# Altium project Dashcam.PrjPcb (part 1 of 8)
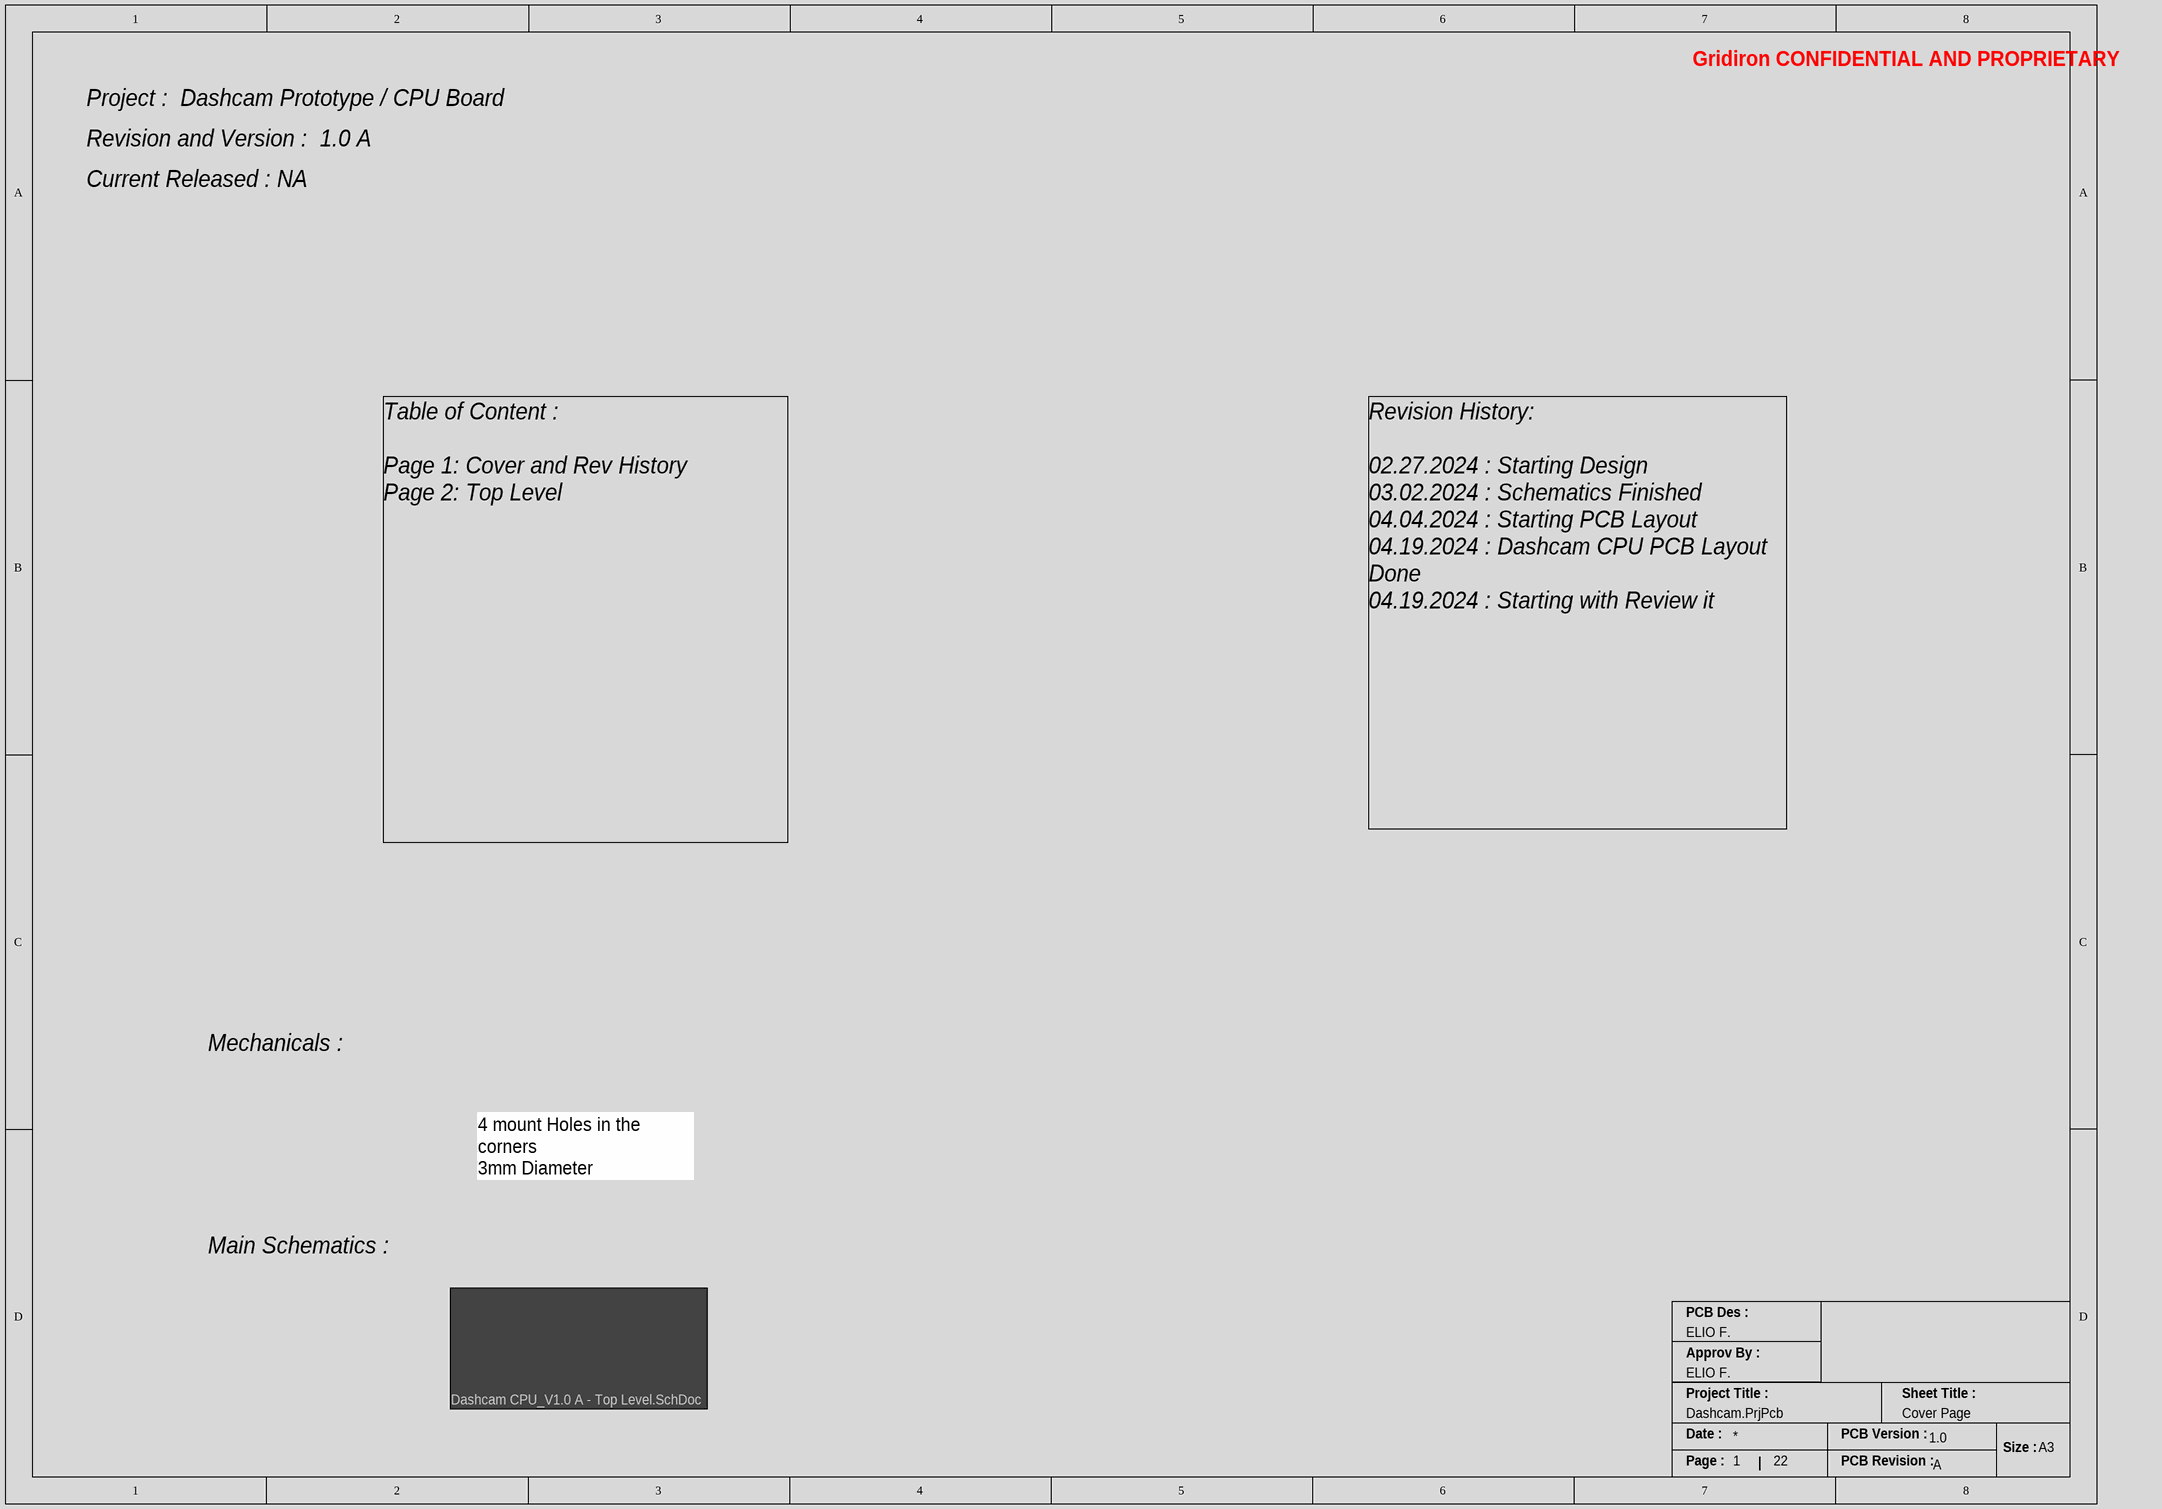
[diagram p0: Dashcam - Cover and Revision.SchDoc]
Letter: A; ProjectTitle: Dashcam CPU_V1.0 A; Version: 1.0
18 sheets, 369 parts. Net scope: hierarchical (ports join the sheet entries above them; power ports are global).
Board file: Dashcam.PcbDoc
Sheets:
  Dashcam - Cover and Revision.SchDoc
  Dashcam - Top Level.SchDoc
    A = iMX 8M PLUS.SchDoc
      H = CPU IO.SchDoc
      K = CPU PHY.SchDoc
      J = CPU MISC.SchDoc
      L = CPU Power.SchDoc
    B = Connector A.SchDoc
    C = Connector B.SchDoc
    Q = PMIC.SchDoc
      P = Converter.SchDoc
    T = DBG.SchDoc
    S = GNSS_GPS.SchDoc
    S = IMU.SchDoc
    S = MAIN_POWER.SchDoc
    S = CAMERA.SchDoc
    S = WIFI_BLE.SchDoc
    S = MICROSD.SchDoc

## Sheet Dashcam - Cover and Revision.SchDoc
size A3; Email: eliofagundez07@gmail.com; DrawnBy: ELIO F.; Engineer: ELIO F.; Revision: A; SheetNumber: 1; SheetTotal: 22; Sheet Title: Cover Page

### Sub-sheets
Z = Dashcam CPU_V1.0 A - Top Level.SchDoc (file not in this document): no entries

### Notes on the sheet
- Project :  Dashcam Prototype / CPU Board
- Gridiron CONFIDENTIAL AND PROPRIETARY
- Revision and Version :  1.0 A
- Current Released : NA
- Table of Content :
  Page 1: Cover and Rev History
  Page 2: Top Level
- Revision History:
  02.27.2024 : Starting Design
  03.02.2024 : Schematics Finished
  04.04.2024 : Starting PCB Layout
  04.19.2024 : Dashcam CPU PCB Layout Done
  04.19.2024 : Starting with Review it
- Mechanicals :
- 4 mount Holes in the corners
  3mm Diameter
- Main Schematics :
- PCB Des :
- Approv By :
- Project Title :
- Sheet Title :
- Date :
- PCB Version :
- Size :
- A3
- Page :
- PCB Revision :

## Sheet Dashcam - Top Level.SchDoc: Top Level
size A2; DrawnBy: ELIO F.; Engineer: ELIO F.; Revision: A; SheetNumber: 2; SheetTotal: 22; Sheet Title: Top Level; Version: 1.0
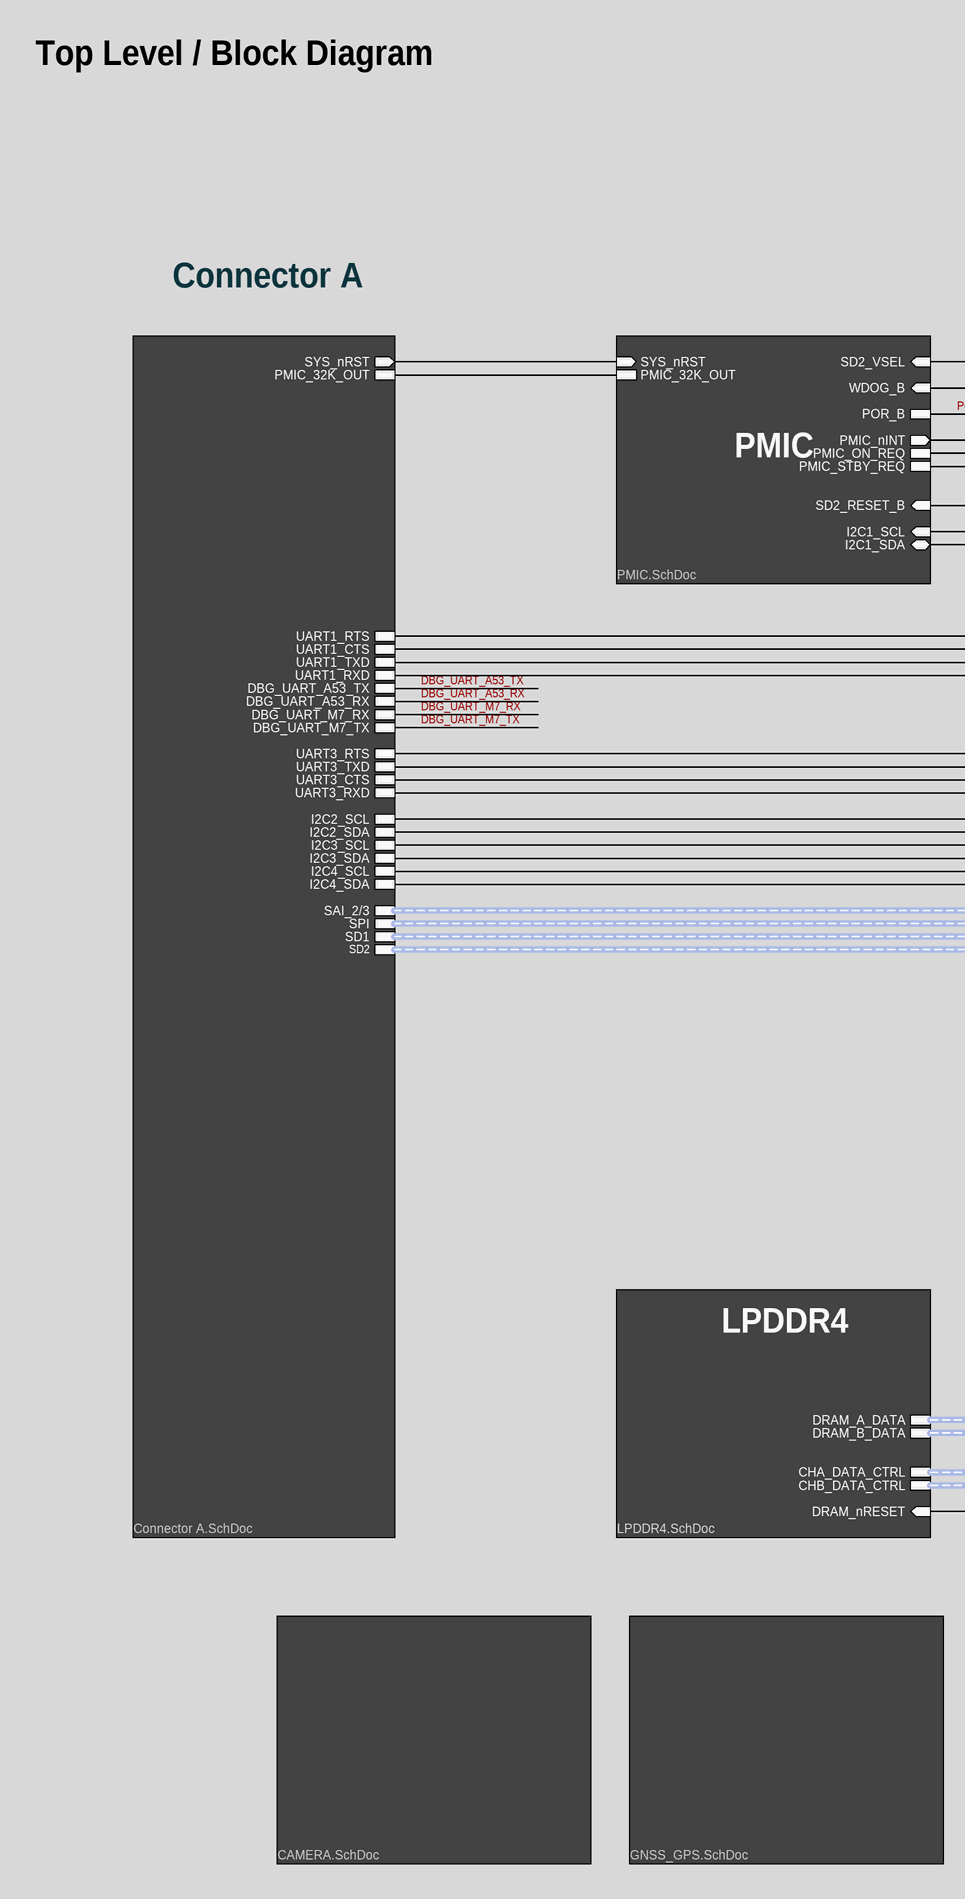
[diagram p1: Dashcam - Top Level.SchDoc, left]
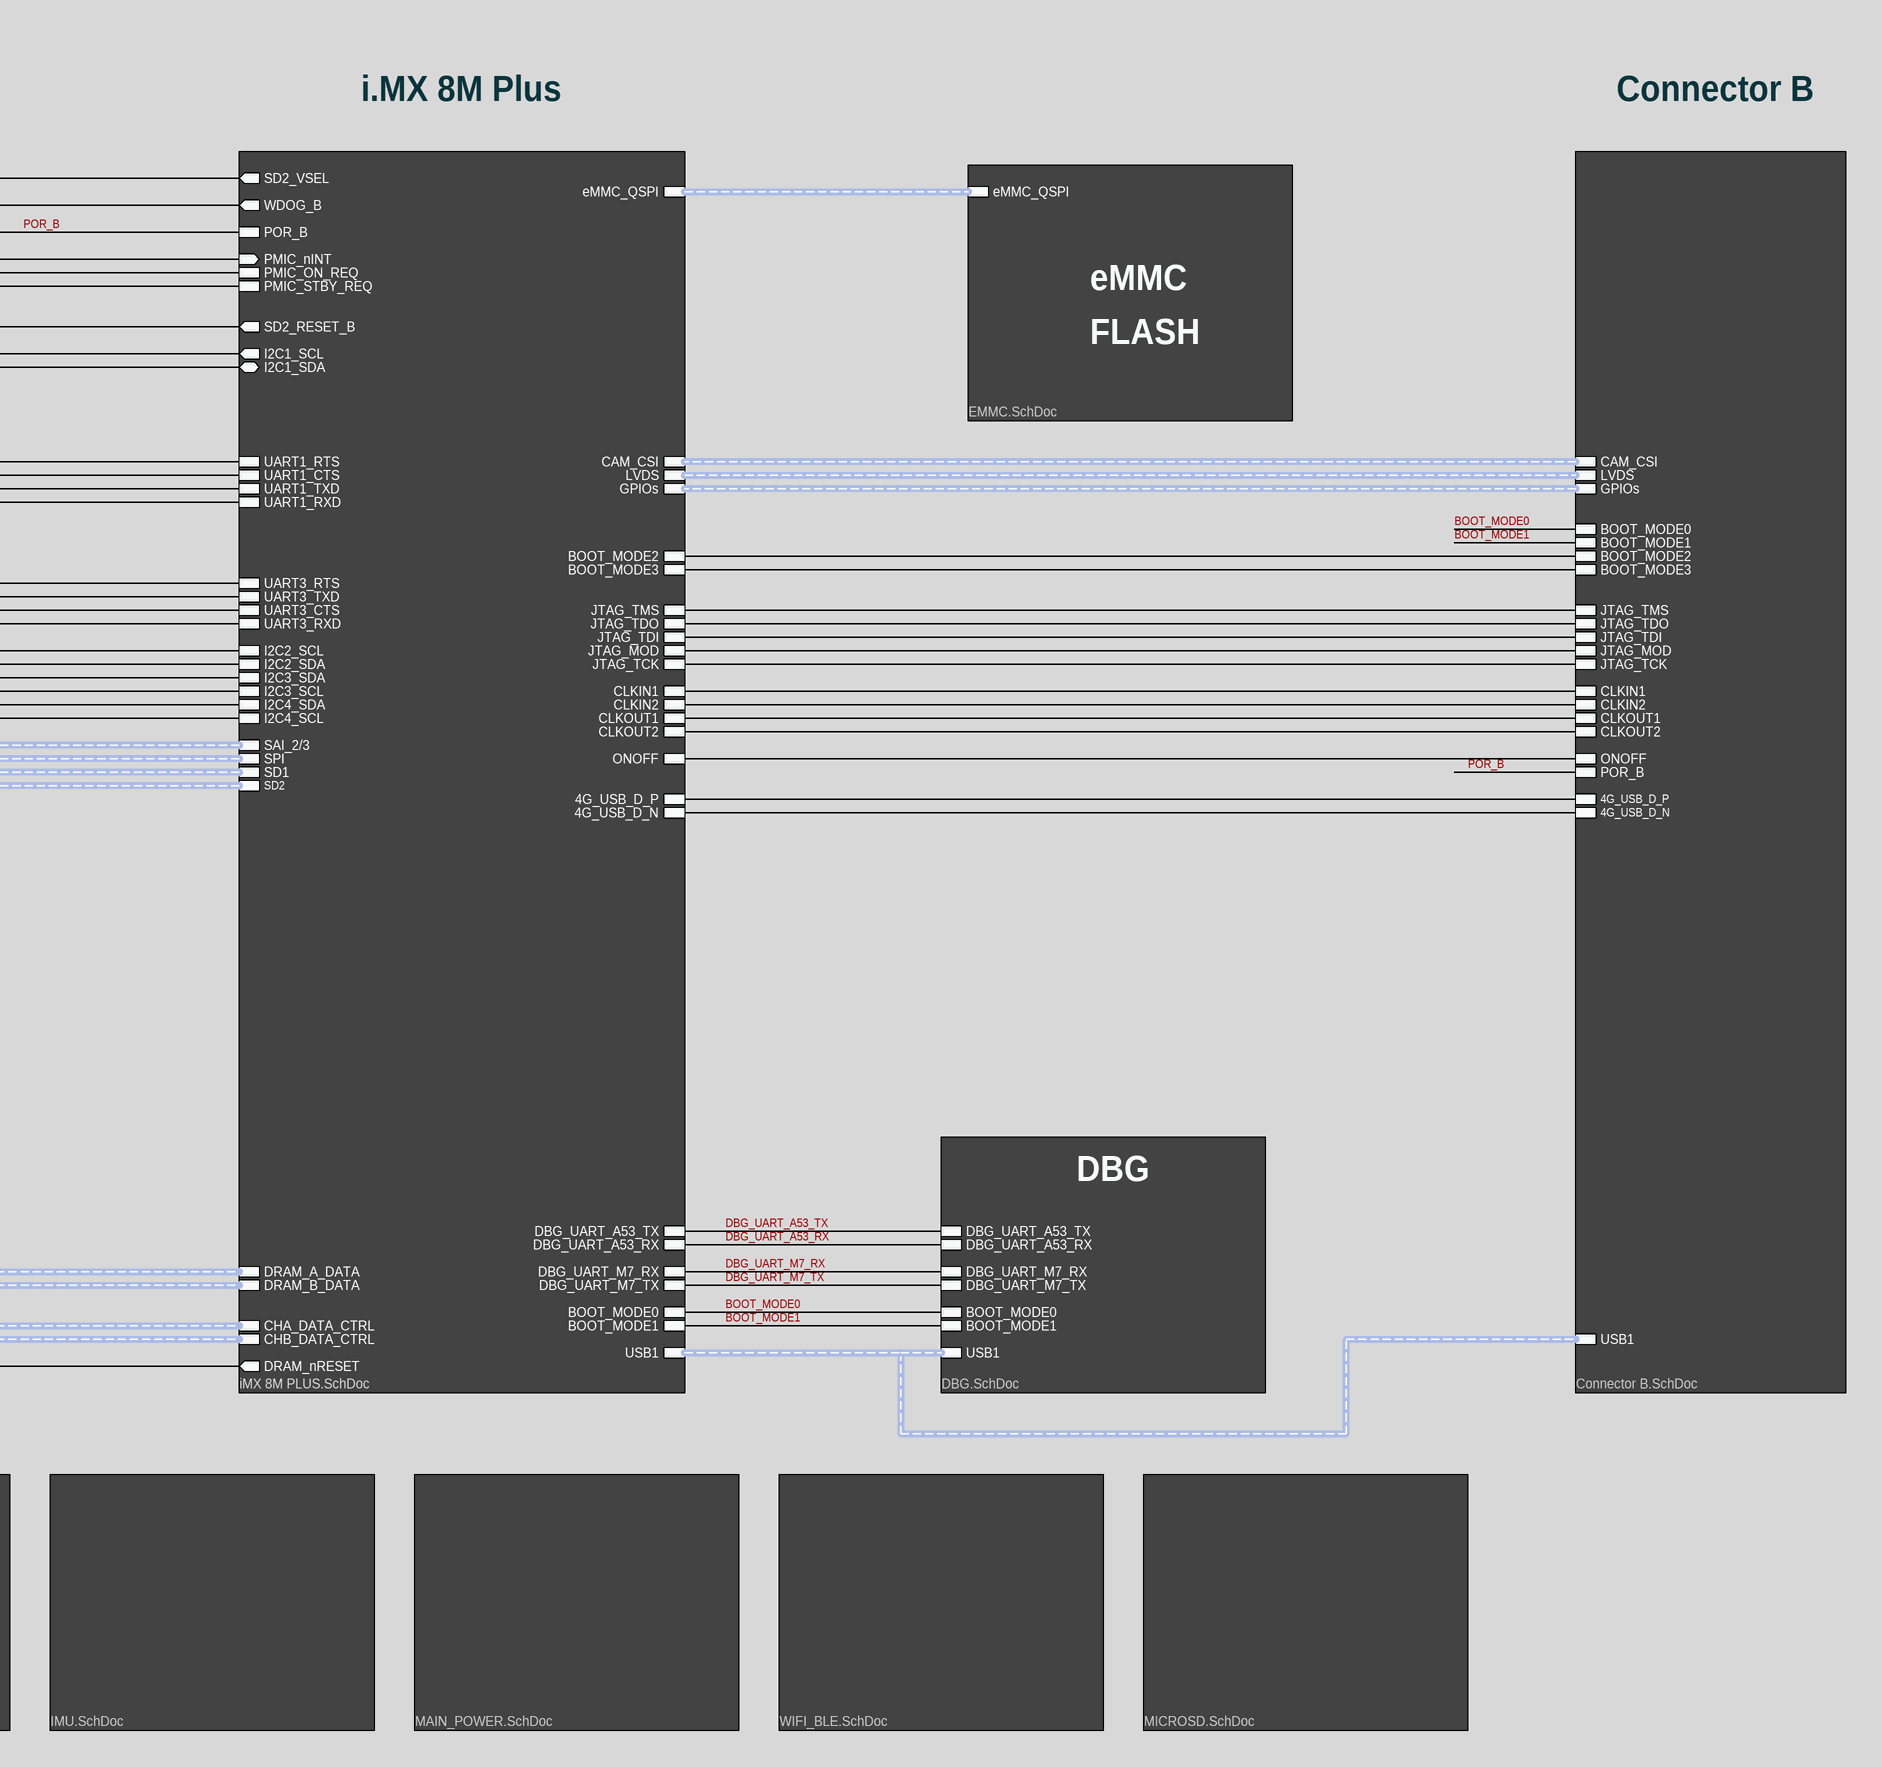
[diagram p2: Dashcam - Top Level.SchDoc, right]

### Sub-sheets
A = iMX 8M PLUS.SchDoc: DRAM_A_DATA (harness DRAM_A), DRAM_B_DATA (harness DRAM_A), CHA_DATA_CTRL (harness DRAM_A), CHB_DATA_CTRL (harness DRAM_A), DRAM_nRESET (out), DBG_UART_A53_TX, DBG_UART_A53_RX, DBG_UART_M7_RX, DBG_UART_M7_TX, BOOT_MODE0, BOOT_MODE1, USB1 (harness DRAM_A), eMMC_QSPI (harness DRAM_A), I2C1_SCL (out), I2C1_SDA (bidir), PMIC_nINT (in), SD2_VSEL (out), WDOG_B (out), SD2_RESET_B (out), ONOFF, POR_B, PMIC_ON_REQ, PMIC_STBY_REQ, UART1_RTS, UART1_CTS, UART1_TXD, UART1_RXD, I2C2_SCL, I2C2_SDA, I2C3_SCL, I2C3_SDA, I2C4_SCL, I2C4_SDA, UART3_RTS, UART3_TXD, UART3_CTS, UART3_RXD, BOOT_MODE2, BOOT_MODE3, CLKIN1, CLKIN2, CLKOUT1, CLKOUT2, CAM_CSI (harness DRAM_A), LVDS (harness DRAM_A), GPIOs (harness DRAM_A), SAI_2/3 (harness DRAM_A), SPI (harness DRAM_A), JTAG_TDI, JTAG_TMS, JTAG_TCK, JTAG_TDO, JTAG_MOD, SD1 (harness DRAM_A), SD2 (harness DRAM_A), 4G_USB_D_P, 4G_USB_D_N
B = Connector A.SchDoc: PMIC_32K_OUT, DBG_UART_A53_TX, DBG_UART_A53_RX, DBG_UART_M7_RX, DBG_UART_M7_TX, UART1_RTS, UART1_CTS, UART1_TXD, UART1_RXD, I2C2_SCL, I2C2_SDA, I2C3_SCL, I2C3_SDA, I2C4_SCL, I2C4_SDA, UART3_RTS, UART3_TXD, UART3_CTS, UART3_RXD, SYS_nRST (out), SAI_2/3 (harness SAI2), SPI (harness SPI), SD1 (harness SD1), SD2 (harness SD2)
C = Connector B.SchDoc: CAM_CSI (harness CAM_CSI), LVDS (harness LVDS), GPIOs (harness GPIOs), USB1 (harness USB1), BOOT_MODE1, BOOT_MODE3, BOOT_MODE0, BOOT_MODE2, JTAG_TMS, JTAG_TDO, JTAG_TDI, JTAG_MOD, JTAG_TCK, ONOFF, CLKIN2, CLKOUT2, CLKIN1, CLKOUT1, POR_B, 4G_USB_D_N, 4G_USB_D_P
Q = PMIC.SchDoc: PMIC_ON_REQ, PMIC_STBY_REQ, WDOG_B (in), SYS_nRST (in), I2C1_SCL (in), I2C1_SDA (bidir), POR_B, PMIC_nINT (out), PMIC_32K_OUT, SD2_RESET_B (in), SD2_VSEL (in)
R = LPDDR4.SchDoc (file not in this document): DRAM_A_DATA (harness DRAM_A_DATA), CHA_DATA_CTRL (harness CHA_DATA_CTRL), DRAM_B_DATA (harness DRAM_B_DATA), CHB_DATA_CTRL (harness CHB_DATA_CTRL), DRAM_nRESET (in)
S = EMMC.SchDoc (file not in this document): eMMC_QSPI (harness eMMC_QSPI)
S = GNSS_GPS.SchDoc: no entries
S = IMU.SchDoc: no entries
S = MAIN_POWER.SchDoc: no entries
S = CAMERA.SchDoc: no entries
S = WIFI_BLE.SchDoc: no entries
S = MICROSD.SchDoc: no entries
T = DBG.SchDoc: DBG_UART_A53_TX, DBG_UART_A53_RX, DBG_UART_M7_RX, DBG_UART_M7_TX, BOOT_MODE0, BOOT_MODE1, USB1 (harness USB1)

### Nets
4G_USB_D_N: sheet A/4G_USB_D_N, sheet C/4G_USB_D_N
4G_USB_D_P: sheet A/4G_USB_D_P, sheet C/4G_USB_D_P
BOOT_MODE0: sheet A/BOOT_MODE0, sheet C/BOOT_MODE0, sheet T/BOOT_MODE0
BOOT_MODE1: sheet A/BOOT_MODE1, sheet C/BOOT_MODE1, sheet T/BOOT_MODE1
BOOT_MODE2: sheet A/BOOT_MODE2, sheet C/BOOT_MODE2
BOOT_MODE3: sheet A/BOOT_MODE3, sheet C/BOOT_MODE3
CLKIN1: sheet A/CLKIN1, sheet C/CLKIN1
CLKIN2: sheet A/CLKIN2, sheet C/CLKIN2
CLKOUT1: sheet A/CLKOUT1, sheet C/CLKOUT1
CLKOUT2: sheet A/CLKOUT2, sheet C/CLKOUT2
DBG_UART_A53_RX: sheet A/DBG_UART_A53_RX, sheet B/DBG_UART_A53_RX, sheet T/DBG_UART_A53_RX
DBG_UART_A53_TX: sheet A/DBG_UART_A53_TX, sheet B/DBG_UART_A53_TX, sheet T/DBG_UART_A53_TX
DBG_UART_M7_RX: sheet A/DBG_UART_M7_RX, sheet B/DBG_UART_M7_RX, sheet T/DBG_UART_M7_RX
DBG_UART_M7_TX: sheet A/DBG_UART_M7_TX, sheet B/DBG_UART_M7_TX, sheet T/DBG_UART_M7_TX
I2C1_SCL: sheet A/I2C1_SCL, sheet Q/I2C1_SCL
I2C1_SDA: sheet A/I2C1_SDA, sheet Q/I2C1_SDA
I2C2_SCL: sheet A/I2C2_SCL, sheet B/I2C2_SCL
I2C2_SDA: sheet A/I2C2_SDA, sheet B/I2C2_SDA
I2C3_SCL: sheet A/I2C3_SCL, sheet B/I2C3_SDA
I2C3_SDA: sheet A/I2C3_SDA, sheet B/I2C3_SCL
I2C4_SCL: sheet A/I2C4_SCL, sheet B/I2C4_SDA
I2C4_SDA: sheet A/I2C4_SDA, sheet B/I2C4_SCL
JTAG_MOD: sheet A/JTAG_MOD, sheet C/JTAG_MOD
JTAG_TCK: sheet A/JTAG_TCK, sheet C/JTAG_TCK
JTAG_TDI: sheet A/JTAG_TDI, sheet C/JTAG_TDI
JTAG_TDO: sheet A/JTAG_TDO, sheet C/JTAG_TDO
JTAG_TMS: sheet A/JTAG_TMS, sheet C/JTAG_TMS
ONOFF: sheet A/ONOFF, sheet C/ONOFF
PMIC_nINT: sheet A/PMIC_nINT, sheet Q/PMIC_nINT
PMIC_ON_REQ: sheet A/PMIC_ON_REQ, sheet Q/PMIC_ON_REQ
PMIC_STBY_REQ: sheet A/PMIC_STBY_REQ, sheet Q/PMIC_STBY_REQ
POR_B: sheet A/POR_B, sheet C/POR_B, sheet Q/POR_B
SD2_VSEL: sheet A/SD2_VSEL, sheet Q/SD2_VSEL
SYS_nRST: sheet B/SYS_nRST, sheet Q/SYS_nRST
UART1_CTS: sheet A/UART1_RTS, sheet B/UART1_RTS
UART1_RTS: sheet A/UART1_CTS, sheet B/UART1_CTS
UART1_RXD: sheet A/UART1_RXD, sheet B/UART1_RXD
UART1_TXD: sheet A/UART1_TXD, sheet B/UART1_TXD
UART3_CTS: sheet A/UART3_CTS, sheet B/UART3_CTS
UART3_RTS: sheet A/UART3_RTS, sheet B/UART3_RTS
UART3_RXD: sheet A/UART3_RXD, sheet B/UART3_RXD
UART3_TXD: sheet A/UART3_TXD, sheet B/UART3_TXD
WDOG_B: sheet A/WDOG_B, sheet Q/WDOG_B
NetR39_1: sheet A/SD2_RESET_B, sheet Q/SD2_RESET_B
NetR49_2: sheet B/PMIC_32K_OUT, sheet Q/PMIC_32K_OUT
(unnamed): sheet A/DRAM_nRESET, sheet R/DRAM_nRESET

### Buses and harness runs
harness sheet A/CAM_CSI = sheet C/CAM_CSI
harness sheet A/CHA_DATA_CTRL = sheet R/CHA_DATA_CTRL
harness sheet A/CHB_DATA_CTRL = sheet R/CHB_DATA_CTRL
harness sheet A/DRAM_A_DATA = sheet R/DRAM_A_DATA
harness sheet A/DRAM_B_DATA = sheet R/DRAM_B_DATA
harness sheet A/eMMC_QSPI = sheet S/eMMC_QSPI
harness sheet A/GPIOs = sheet C/GPIOs
harness sheet A/LVDS = sheet C/LVDS
harness sheet A/SAI_2/3 = sheet B/SAI_2/3
harness sheet A/SD1 = sheet B/SD1
harness sheet A/SD2 = sheet B/SD2
harness sheet A/SPI = sheet B/SPI
harness sheet A/USB1 = sheet C/USB1 = sheet T/USB1

### Notes on the sheet
- Top Level / Block Diagram
- Connector A
- i.MX 8M Plus
- Connector B
- PMIC
- eMMC
- FLASH
- LPDDR4
- DBG
- PCB Des :
- Approv By :
- Project Title :
- Sheet Title :
- Date :
- Page :
- PCB Version :
- PCB Revision :
- Size :
- A2

## Sheet iMX 8M PLUS.SchDoc: i.MX 8M - BLOCK DIAGRAM
size A3; DrawnBy: ELIO F.; Engineer: ELIO F.; Revision: A; SheetNumber: 3; SheetTotal: 16
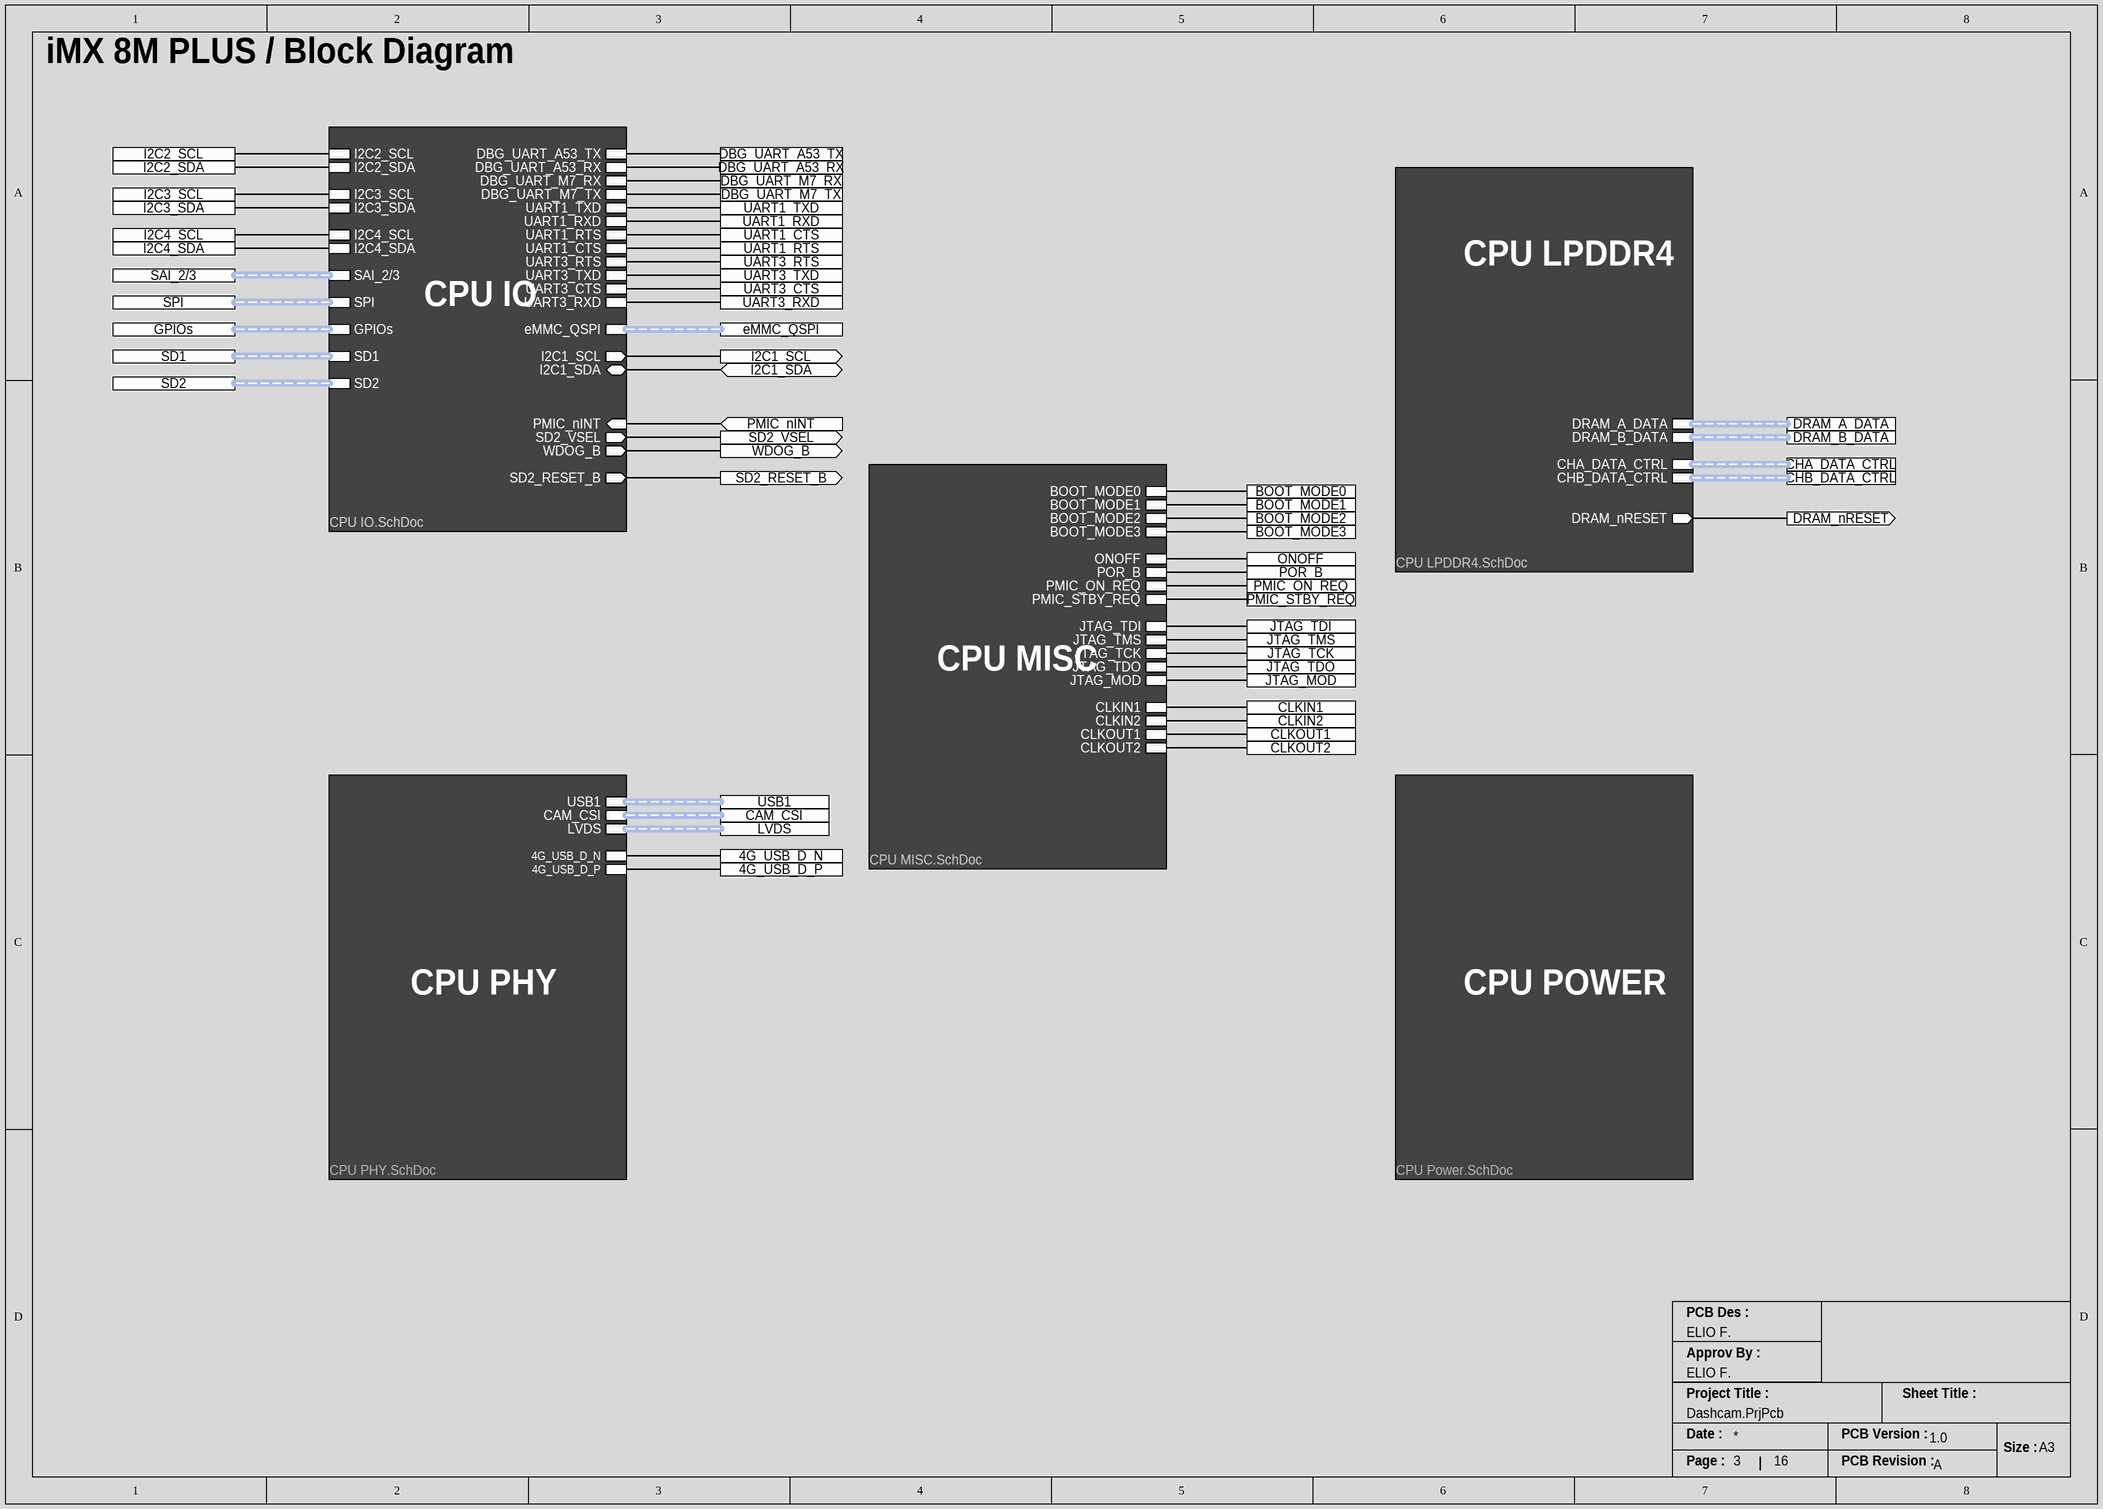
[diagram p3: iMX 8M PLUS.SchDoc]

### Sub-sheets
H = CPU IO.SchDoc: DBG_UART_A53_TX, DBG_UART_A53_RX, DBG_UART_M7_RX, DBG_UART_M7_TX, eMMC_QSPI (harness NAND), I2C1_SCL (out), I2C1_SDA (bidir), PMIC_nINT (in), SD2_VSEL (out), WDOG_B (out), SD2_RESET_B (out), UART1_TXD, UART1_RXD, UART1_RTS, UART1_CTS, I2C2_SCL, I2C2_SDA, I2C3_SCL, I2C3_SDA, I2C4_SCL, I2C4_SDA, UART3_RTS, UART3_TXD, UART3_CTS, UART3_RXD, GPIOs (harness GPIOs), SPI (harness SPI), SAI_2/3 (harness SAI2), SD1 (harness SD1), SD2 (harness SD2)
I = CPU LPDDR4.SchDoc (file not in this document): DRAM_nRESET (out), DRAM_A_DATA (harness DRAM_A_DATA), CHA_DATA_CTRL (harness CHA_DATA_CTRL), DRAM_B_DATA (harness DRAM_B_DATA), CHB_DATA_CTRL (harness CHB_DATA_CTRL)
J = CPU MISC.SchDoc: BOOT_MODE0, BOOT_MODE1, ONOFF, POR_B, PMIC_ON_REQ, PMIC_STBY_REQ, CLKIN1, CLKIN2, CLKOUT1, CLKOUT2, BOOT_MODE2, BOOT_MODE3, JTAG_TDI, JTAG_TMS, JTAG_TCK, JTAG_TDO, JTAG_MOD
K = CPU PHY.SchDoc: USB1 (harness USB), CAM_CSI (harness CAM_CSI), LVDS (harness LVDS), 4G_USB_D_N, 4G_USB_D_P
L = CPU Power.SchDoc: no entries

### Ports
4G_USB_D_N, 4G_USB_D_P, BOOT_MODE0, BOOT_MODE1, BOOT_MODE2, BOOT_MODE3, CAM_CSI (harness DRAM_A), CHA_DATA_CTRL (harness DRAM_A), CHB_DATA_CTRL (harness DRAM_A), CLKIN1, CLKIN2, CLKOUT1, CLKOUT2, DBG_UART_A53_RX, DBG_UART_A53_TX, DBG_UART_M7_RX, DBG_UART_M7_TX, DRAM_A_DATA (harness DRAM_A), DRAM_B_DATA (harness DRAM_A), DRAM_nRESET (out), eMMC_QSPI (harness DRAM_A), GPIOs (harness DRAM_A), I2C1_SCL (out), I2C1_SDA (bidir), I2C2_SCL, I2C2_SDA, I2C3_SCL, I2C3_SDA, I2C4_SCL, I2C4_SDA, JTAG_MOD, JTAG_TCK, JTAG_TDI, JTAG_TDO, JTAG_TMS, LVDS (harness DRAM_A), ONOFF, PMIC_nINT (in), PMIC_ON_REQ, PMIC_STBY_REQ, POR_B, SAI_2/3 (harness DRAM_A), SD1 (harness DRAM_A), SD2 (harness DRAM_A), SD2_RESET_B (out), SD2_VSEL (out), SPI (harness DRAM_A), UART1_CTS, UART1_RTS, UART1_RXD, UART1_TXD, UART3_CTS, UART3_RTS, UART3_RXD, UART3_TXD, USB1 (harness DRAM_A), WDOG_B (out)

### Nets
4G_USB_D_N: port 4G_USB_D_N, sheet K/4G_USB_D_N
4G_USB_D_P: port 4G_USB_D_P, sheet K/4G_USB_D_P
BOOT_MODE0: port BOOT_MODE0, sheet J/BOOT_MODE0
BOOT_MODE1: port BOOT_MODE1, sheet J/BOOT_MODE1
BOOT_MODE2: port BOOT_MODE2, sheet J/BOOT_MODE2
BOOT_MODE3: port BOOT_MODE3, sheet J/BOOT_MODE3
CLKIN1: port CLKIN1, sheet J/CLKIN1
CLKIN2: port CLKIN2, sheet J/CLKIN2
CLKOUT1: port CLKOUT1, sheet J/CLKOUT1
CLKOUT2: port CLKOUT2, sheet J/CLKOUT2
DBG_UART_A53_RX: port DBG_UART_A53_RX, sheet H/DBG_UART_A53_RX
DBG_UART_A53_TX: port DBG_UART_A53_TX, sheet H/DBG_UART_A53_TX
DBG_UART_M7_RX: port DBG_UART_M7_RX, sheet H/DBG_UART_M7_RX
DBG_UART_M7_TX: port DBG_UART_M7_TX, sheet H/DBG_UART_M7_TX
I2C1_SCL: port I2C1_SCL, sheet H/I2C1_SCL
I2C1_SDA: port I2C1_SDA, sheet H/I2C1_SDA
I2C2_SCL: port I2C2_SCL, sheet H/I2C2_SCL
I2C2_SDA: port I2C2_SDA, sheet H/I2C2_SDA
I2C3_SCL: port I2C3_SCL, sheet H/I2C3_SCL
I2C3_SDA: port I2C3_SDA, sheet H/I2C3_SDA
I2C4_SCL: port I2C4_SCL, sheet H/I2C4_SCL
I2C4_SDA: port I2C4_SDA, sheet H/I2C4_SDA
JTAG_MOD: port JTAG_MOD, sheet J/JTAG_MOD
JTAG_TCK: port JTAG_TCK, sheet J/JTAG_TCK
JTAG_TDI: port JTAG_TDI, sheet J/JTAG_TDI
JTAG_TDO: port JTAG_TDO, sheet J/JTAG_TDO
JTAG_TMS: port JTAG_TMS, sheet J/JTAG_TMS
ONOFF: port ONOFF, sheet J/ONOFF
PMIC_nINT: port PMIC_nINT, sheet H/PMIC_nINT
PMIC_ON_REQ: port PMIC_ON_REQ, sheet J/PMIC_ON_REQ
PMIC_STBY_REQ: port PMIC_STBY_REQ, sheet J/PMIC_STBY_REQ
POR_B: port POR_B, sheet J/POR_B
SD2_VSEL: port SD2_VSEL, sheet H/SD2_VSEL
UART1_CTS: port UART1_RTS, sheet H/UART1_CTS
UART1_RTS: port UART1_CTS, sheet H/UART1_RTS
UART1_RXD: port UART1_RXD, sheet H/UART1_RXD
UART1_TXD: port UART1_TXD, sheet H/UART1_TXD
UART3_CTS: port UART3_CTS, sheet H/UART3_CTS
UART3_RTS: port UART3_RTS, sheet H/UART3_RTS
UART3_RXD: port UART3_RXD, sheet H/UART3_RXD
UART3_TXD: port UART3_TXD, sheet H/UART3_TXD
WDOG_B: port WDOG_B, sheet H/WDOG_B
NetR39_1: port SD2_RESET_B, sheet H/SD2_RESET_B
(unnamed): port DRAM_nRESET, sheet I/DRAM_nRESET

### Buses and harness runs
harness port CAM_CSI = sheet K/CAM_CSI
harness port CHA_DATA_CTRL = sheet I/CHA_DATA_CTRL
harness port CHB_DATA_CTRL = sheet I/CHB_DATA_CTRL
harness port DRAM_A_DATA = sheet I/DRAM_A_DATA
harness port DRAM_B_DATA = sheet I/DRAM_B_DATA
harness port eMMC_QSPI = sheet H/eMMC_QSPI
harness port GPIOs = sheet H/GPIOs
harness port LVDS = sheet K/LVDS
harness port SAI_2/3 = sheet H/SAI_2/3
harness port SD1 = sheet H/SD1
harness port SD2 = sheet H/SD2
harness port SPI = sheet H/SPI
harness port USB1 = sheet K/USB1

### Notes on the sheet
- iMX 8M PLUS / Block Diagram
- CPU IO
- CPU LPDDR4
- CPU MISC
- CPU PHY
- CPU POWER
- PCB Des :
- Approv By :
- Project Title :
- Sheet Title :
- Date :
- PCB Version :
- Size :
- A3
- Page :
- PCB Revision :

## Sheet CPU IO.SchDoc: CPU IO
size A2; DrawnBy: ELIO F.; Engineer: ELIO F.; Revision: A; SheetNumber: 8; SheetTotal: 22
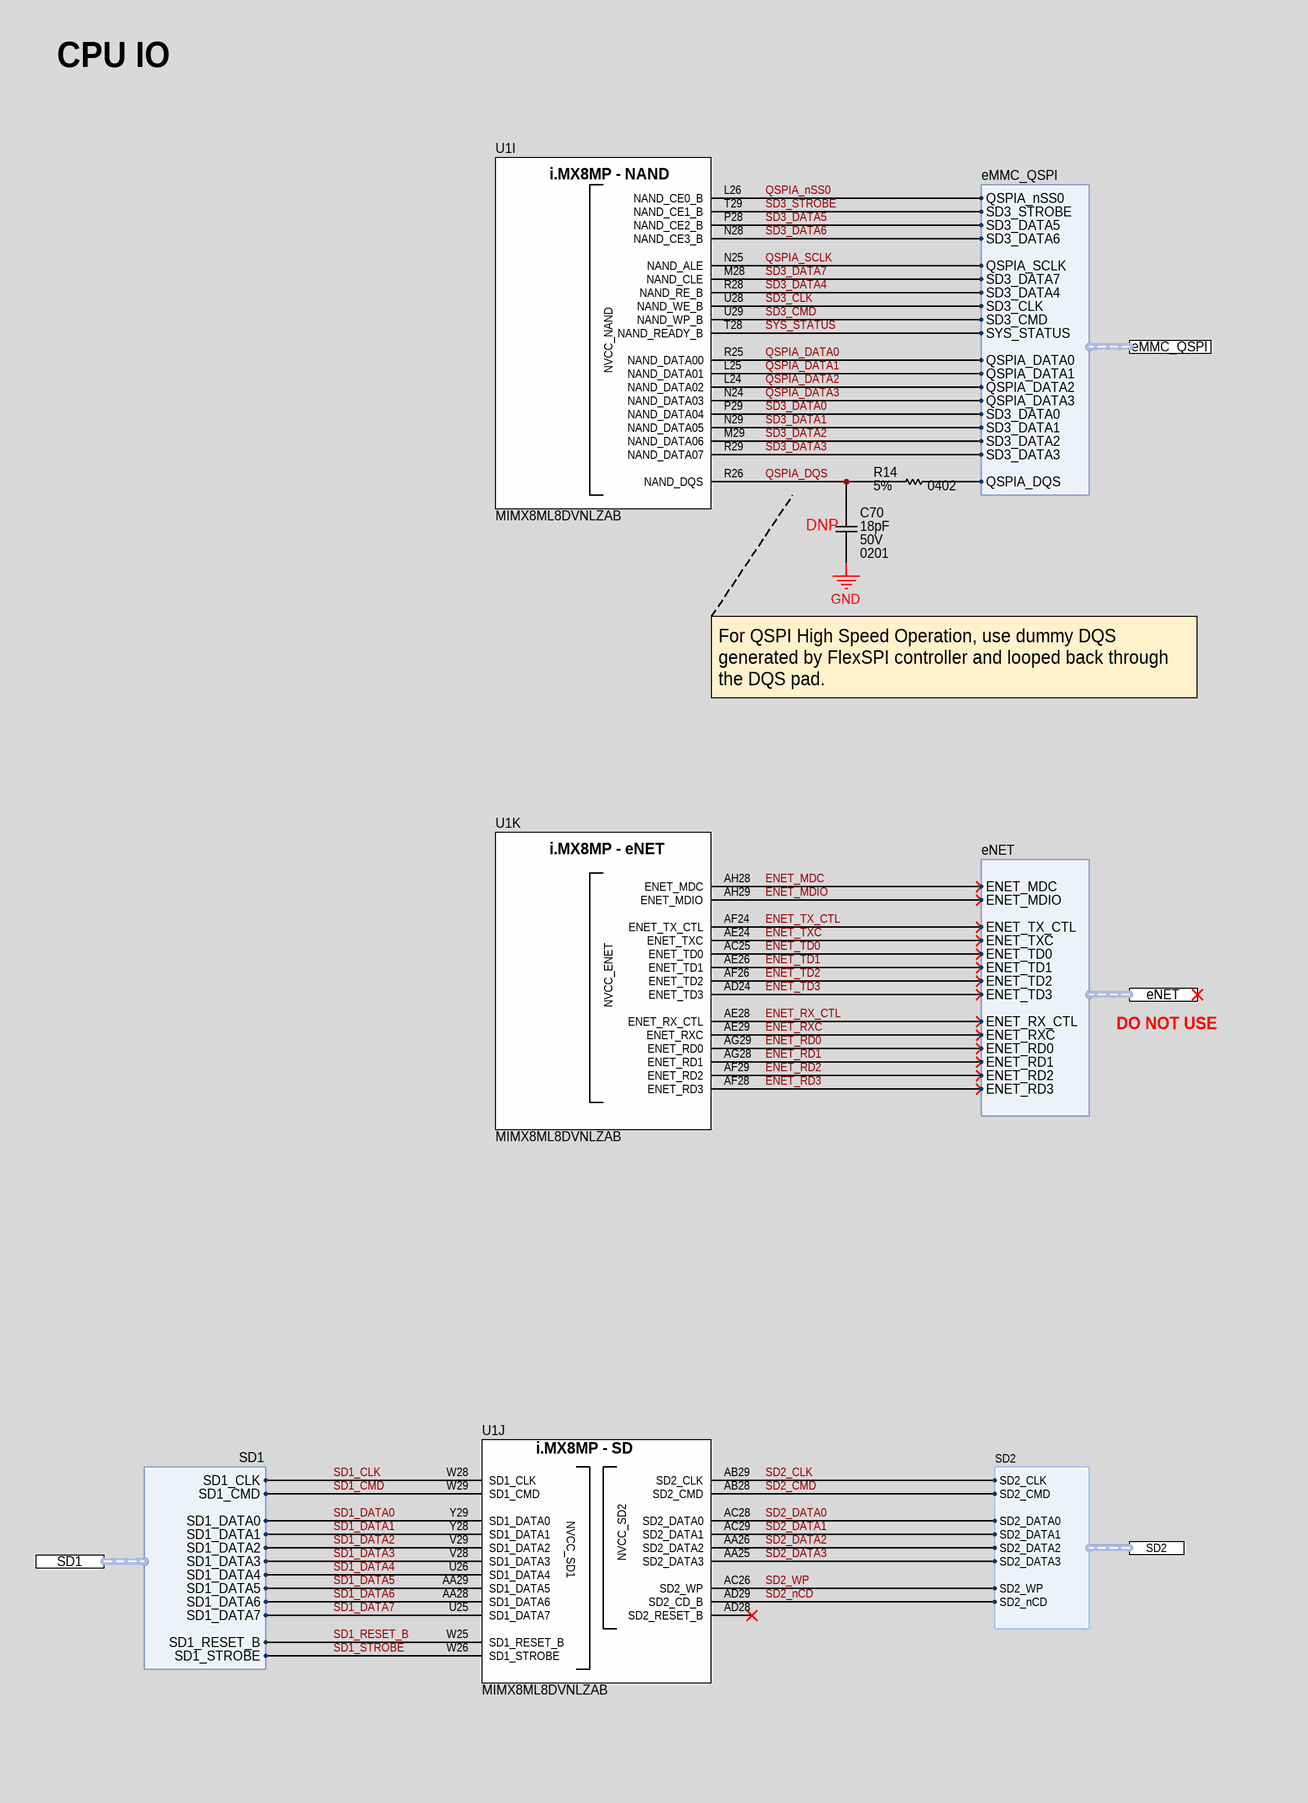
[diagram p4: CPU IO.SchDoc, left]
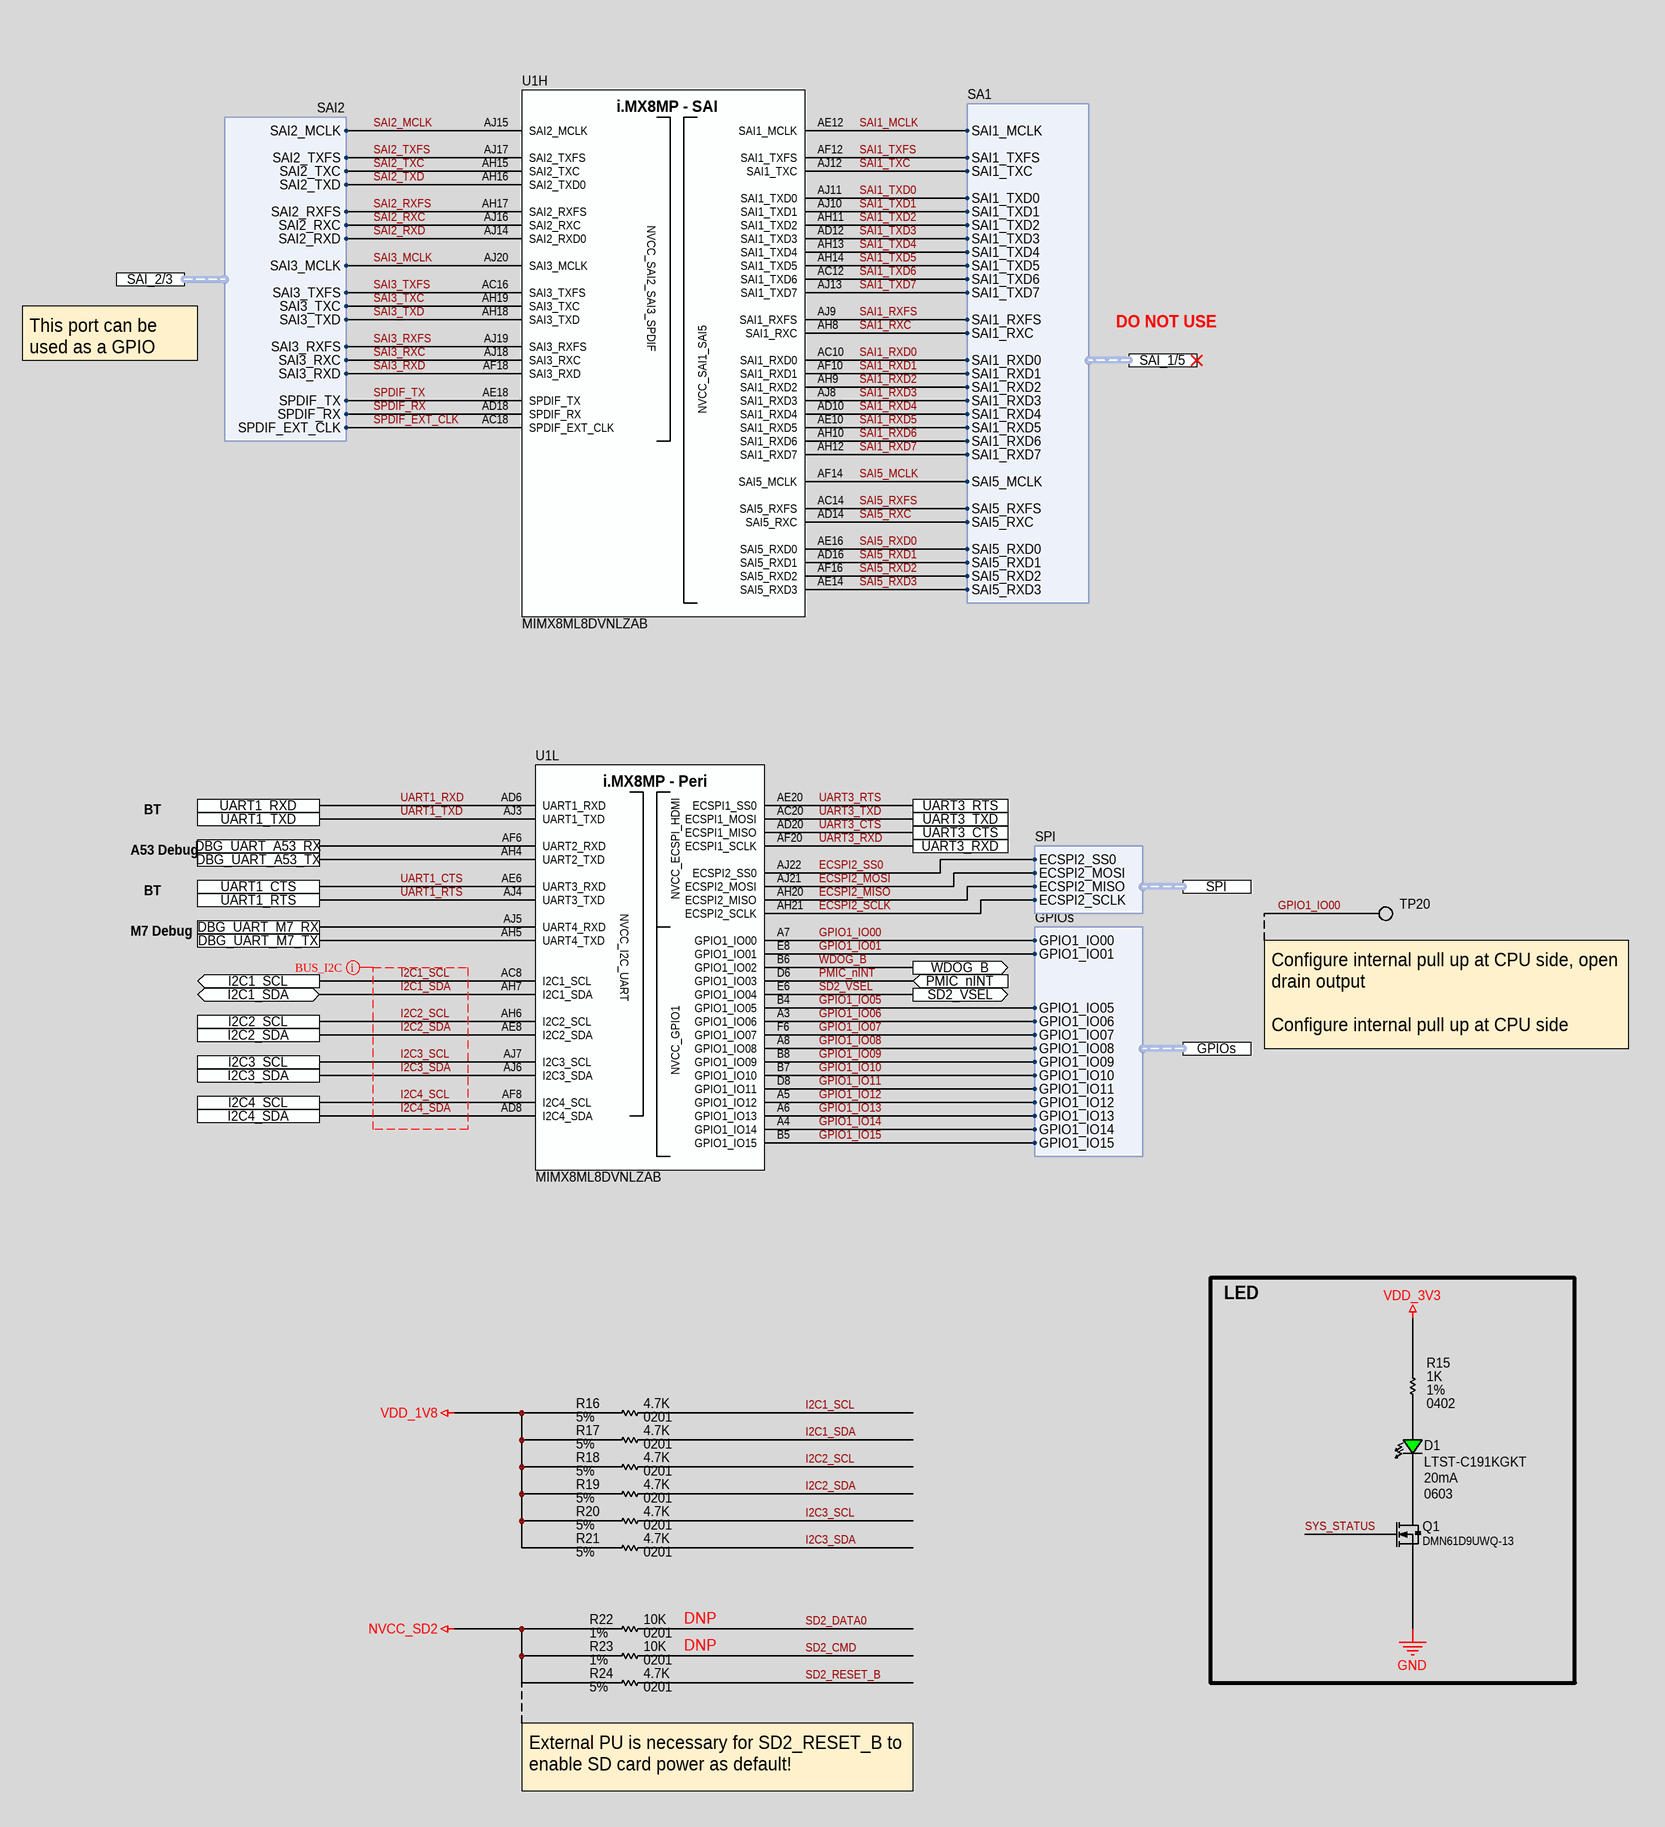
[diagram p5: CPU IO.SchDoc, right]

### Parts
C70  Capacitance: 18pF  Voltage Rating: 50V  Case/Package: 0201  [CAP_0201_CAPC0603X03N]  (hidden comment: GRM0335C1H180JA01D)
D1  LTST-C191KGKT  Test Current: 20mA  Case/Package: 0603  [LED_0603-GREEN]
Q1  DMN61D9UWQ-13  [SOT-323]
R14  Case Code (Imperial): 0402  Tolerance: 5%  [RES_0402_RESC1005X04N]  (hidden comment: ERJ-2GE0R00X)
R15  Resistance: 1K  Tolerance: 1%  Case/Package: 0402  [RES_0402_RESC1005X04N]  (hidden comment: ERJ-2RKF1001X)
R16  Tolerance: 5%  Resistance: 4.7K  Case/Package: 0201  [RES_0201_RESC0603X02N]  (hidden comment: RK73B1HTTC472J)
R17  Tolerance: 5%  Resistance: 4.7K  Case/Package: 0201  [RES_0201_RESC0603X02N]  (hidden comment: RK73B1HTTC472J)
R18  Tolerance: 5%  Resistance: 4.7K  Case/Package: 0201  [RES_0201_RESC0603X02N]  (hidden comment: RK73B1HTTC472J)
R19  Tolerance: 5%  Resistance: 4.7K  Case/Package: 0201  [RES_0201_RESC0603X02N]  (hidden comment: RK73B1HTTC472J)
R20  Tolerance: 5%  Resistance: 4.7K  Case/Package: 0201  [RES_0201_RESC0603X02N]  (hidden comment: RK73B1HTTC472J)
R21  Tolerance: 5%  Resistance: 4.7K  Case/Package: 0201  [RES_0201_RESC0603X02N]  (hidden comment: RK73B1HTTC472J)
R22  Tolerance: 1%  Resistance: 10K  Case Code (Imperial): 0201  [RES_0201_RESC0603X02N]  (hidden comment: RC0201FR-0710KL)
R23  Tolerance: 1%  Resistance: 10K  Case Code (Imperial): 0201  [RES_0201_RESC0603X02N]  (hidden comment: RC0201FR-0710KL)
R24  Tolerance: 5%  Resistance: 4.7K  Case/Package: 0201  [RES_0201_RESC0603X02N]  (hidden comment: RK73B1HTTC472J)
TP20  NO COMPONENT  [TP_PAD_0.5MM_SMD_ROUND]  (value not drawn)  (no BOM)
U1  MIMX8ML8DVNLZAB  [IC_MPU_BGA548C50P29X29_1500X1500X148]  (parts H,I,J,K,L of 15)

### Blocks framed on the sheet
LED: D1 Q1 R15

### Ports
DBG_UART_A53_RX, DBG_UART_A53_TX, DBG_UART_M7_RX, DBG_UART_M7_TX, eMMC_QSPI (harness eMMC_QSPI), eNET (harness eNET), GPIOs (harness GPIOs), I2C1_SCL (out), I2C1_SDA (bidir), I2C2_SCL, I2C2_SDA, I2C3_SCL, I2C3_SDA, I2C4_SCL, I2C4_SDA, PMIC_nINT (in), SAI_1/5 (harness SA1), SAI_2/3 (harness SAI2), SD1 (harness SD1), SD2 (harness SD2), SD2_VSEL (out), SPI (harness SPI), UART1_CTS, UART1_RTS, UART1_RXD, UART1_TXD, UART3_CTS, UART3_RTS, UART3_RXD, UART3_TXD, WDOG_B (out)

### Harnesses
eMMC_QSPI: SD3_STROBE, SD3_DATA5, SD3_DATA6, SD3_DATA7, SD3_DATA4, SD3_CLK, SD3_CMD, SYS_STATUS, QSPIA_DATA0, QSPIA_DATA1, QSPIA_DATA2, QSPIA_DATA3, QSPIA_nSS0, SD3_DATA0, QSPIA_SCLK, SD3_DATA1, SD3_DATA2, SD3_DATA3, QSPIA_DQS
eNET: ENET_MDC, ENET_MDIO, ENET_TX_CTL, ENET_TXC, ENET_TD0, ENET_TD1, ENET_TD2, ENET_TD3, ENET_RX_CTL, ENET_RXC, ENET_RD0, ENET_RD1, ENET_RD2, ENET_RD3
SD1: SD1_CMD, SD1_DATA0, SD1_DATA1, SD1_DATA2, SD1_DATA3, SD1_DATA4, SD1_DATA6, SD1_DATA7, SD1_RESET_B, SD1_STROBE, SD1_CLK, SD1_DATA5
SAI2: SAI2_MCLK, SAI2_TXFS, SAI2_TXC, SAI2_TXD, SAI2_RXFS, SAI2_RXC, SAI2_RXD, SAI3_MCLK, SAI3_TXFS, SAI3_TXC, SAI3_TXD, SAI3_RXFS, SAI3_RXC, SAI3_RXD, SPDIF_TX, SPDIF_RX, SPDIF_EXT_CLK
SA1: SAI1_MCLK, SAI1_TXFS, SAI1_TXC, SAI1_TXD0, SAI1_TXD1, SAI1_TXD2, SAI1_TXD3, SAI1_TXD4, SAI1_TXD5, SAI1_TXD6, SAI1_TXD7, SAI1_RXFS, SAI1_RXC, SAI1_RXD0, SAI1_RXD1, SAI1_RXD2, SAI1_RXD3, SAI1_RXD4, SAI1_RXD5, SAI1_RXD6, SAI1_RXD7, SAI5_MCLK, SAI5_RXFS, SAI5_RXC, SAI5_RXD0, SAI5_RXD1, SAI5_RXD2, SAI5_RXD3
GPIOs: GPIO1_IO00, GPIO1_IO01, GPIO1_IO05, GPIO1_IO06, GPIO1_IO07, GPIO1_IO08, GPIO1_IO09, GPIO1_IO10, GPIO1_IO11, GPIO1_IO12, GPIO1_IO13, GPIO1_IO14, GPIO1_IO15
SPI: ECSPI2_SS0, ECSPI2_MOSI, ECSPI2_MISO, ECSPI2_SCLK
SD2: SD2_CLK, SD2_CMD, SD2_DATA0, SD2_DATA1, SD2_DATA2, SD2_DATA3, SD2_WP, SD2_nCD

### Nets
GND: C70.1 Q1.S
NVCC_SD2: R22.1 R23.1 R24.1
VDD_1V8: R16.1 R17.1 R18.1 R19.1 R20.1 R21.1
VDD_3V3: R15.2
DBG_UART_A53_RX: U1.AF6(UART2_RXD) ; port DBG_UART_A53_RX
DBG_UART_A53_TX: U1.AH4(UART2_TXD) ; port DBG_UART_A53_TX
DBG_UART_M7_RX: U1.AJ5(UART4_RXD) ; port DBG_UART_M7_RX
DBG_UART_M7_TX: U1.AH5(UART4_TXD) ; port DBG_UART_M7_TX
ECSPI2_MISO: U1.AH20(ECSPI2_MISO) ; port SPI.ECSPI2_MISO
ECSPI2_MOSI: U1.AJ21(ECSPI2_MOSI) ; port SPI.ECSPI2_MOSI
ECSPI2_SCLK: U1.AH21(ECSPI2_SCLK) ; port SPI.ECSPI2_SCLK
ECSPI2_SS0: U1.AJ22(ECSPI2_SS0) ; port SPI.ECSPI2_SS0
ENET_MDC: U1.AH28(ENET_MDC) ; port eNET.ENET_MDC
ENET_MDIO: U1.AH29(ENET_MDIO) ; port eNET.ENET_MDIO
ENET_RD0: U1.AG29(ENET_RD0) ; port eNET.ENET_RD0
ENET_RD1: U1.AG28(ENET_RD1) ; port eNET.ENET_RD1
ENET_RD2: U1.AF29(ENET_RD2) ; port eNET.ENET_RD2
ENET_RD3: U1.AF28(ENET_RD3) ; port eNET.ENET_RD3
ENET_RX_CTL: U1.AE28(ENET_RX_CTL) ; port eNET.ENET_RX_CTL
ENET_RXC: U1.AE29(ENET_RXC) ; port eNET.ENET_RXC
ENET_TD0: U1.AC25(ENET_TD0) ; port eNET.ENET_TD0
ENET_TD1: U1.AE26(ENET_TD1) ; port eNET.ENET_TD1
ENET_TD2: U1.AF26(ENET_TD2) ; port eNET.ENET_TD2
ENET_TD3: U1.AD24(ENET_TD3) ; port eNET.ENET_TD3
ENET_TX_CTL: U1.AF24(ENET_TX_CTL) ; port eNET.ENET_TX_CTL
ENET_TXC: U1.AE24(ENET_TXC) ; port eNET.ENET_TXC
GPIO1_IO00: TP20.1 U1.A7(GPIO1_IO00) ; port GPIOs.GPIO1_IO00
GPIO1_IO01: U1.E8(GPIO1_IO01) ; port GPIOs.GPIO1_IO01
GPIO1_IO05: U1.B4(GPIO1_IO05) ; port GPIOs.GPIO1_IO05
GPIO1_IO06: U1.A3(GPIO1_IO06) ; port GPIOs.GPIO1_IO06
GPIO1_IO07: U1.F6(GPIO1_IO07) ; port GPIOs.GPIO1_IO07
GPIO1_IO08: U1.A8(GPIO1_IO08) ; port GPIOs.GPIO1_IO08
GPIO1_IO09: U1.B8(GPIO1_IO09) ; port GPIOs.GPIO1_IO09
GPIO1_IO10: U1.B7(GPIO1_IO10) ; port GPIOs.GPIO1_IO10
GPIO1_IO11: U1.D8(GPIO1_IO11) ; port GPIOs.GPIO1_IO11
GPIO1_IO12: U1.A5(GPIO1_IO12) ; port GPIOs.GPIO1_IO12
GPIO1_IO13: U1.A6(GPIO1_IO13) ; port GPIOs.GPIO1_IO13
GPIO1_IO14: U1.A4(GPIO1_IO14) ; port GPIOs.GPIO1_IO14
GPIO1_IO15: U1.B5(GPIO1_IO15) ; port GPIOs.GPIO1_IO15
I2C1_SCL: R16.2 U1.AC8(I2C1_SCL) ; port I2C1_SCL
I2C1_SDA: R17.2 U1.AH7(I2C1_SDA) ; port I2C1_SDA
I2C2_SCL: R18.2 U1.AH6(I2C2_SCL) ; port I2C2_SCL
I2C2_SDA: R19.2 U1.AE8(I2C2_SDA) ; port I2C2_SDA
I2C3_SCL: R20.2 U1.AJ7(I2C3_SCL) ; port I2C3_SCL
I2C3_SDA: R21.2 U1.AJ6(I2C3_SDA) ; port I2C3_SDA
I2C4_SCL: U1.AF8(I2C4_SCL) ; port I2C4_SCL
I2C4_SDA: U1.AD8(I2C4_SDA) ; port I2C4_SDA
PMIC_nINT: U1.D6(GPIO1_IO03) ; port PMIC_nINT
QSPIA_DATA0: U1.R25(NAND_DATA00) ; port eMMC_QSPI.QSPIA_DATA0
QSPIA_DATA1: U1.L25(NAND_DATA01) ; port eMMC_QSPI.QSPIA_DATA1
QSPIA_DATA2: U1.L24(NAND_DATA02) ; port eMMC_QSPI.QSPIA_DATA2
QSPIA_DATA3: U1.N24(NAND_DATA03) ; port eMMC_QSPI.QSPIA_DATA3
QSPIA_DQS: C70.2 R14.1 U1.R26(NAND_DQS)
QSPIA_nSS0: U1.L26(NAND_CE0_B) ; port eMMC_QSPI.QSPIA_nSS0
QSPIA_SCLK: U1.N25(NAND_ALE) ; port eMMC_QSPI.QSPIA_SCLK
SAI1_MCLK: U1.AE12(SAI1_MCLK) ; port SAI_1/5.SAI1_MCLK
SAI1_RXC: U1.AH8(SAI1_RXC) ; port SAI_1/5.SAI1_RXC
SAI1_RXD0: U1.AC10(SAI1_RXD0) ; port SAI_1/5.SAI1_RXD0
SAI1_RXD1: U1.AF10(SAI1_RXD1) ; port SAI_1/5.SAI1_RXD1
SAI1_RXD2: U1.AH9(SAI1_RXD2) ; port SAI_1/5.SAI1_RXD2
SAI1_RXD3: U1.AJ8(SAI1_RXD3) ; port SAI_1/5.SAI1_RXD3
SAI1_RXD4: U1.AD10(SAI1_RXD4) ; port SAI_1/5.SAI1_RXD4
SAI1_RXD5: U1.AE10(SAI1_RXD5) ; port SAI_1/5.SAI1_RXD5
SAI1_RXD6: U1.AH10(SAI1_RXD6) ; port SAI_1/5.SAI1_RXD6
SAI1_RXD7: U1.AH12(SAI1_RXD7) ; port SAI_1/5.SAI1_RXD7
SAI1_RXFS: U1.AJ9(SAI1_RXFS) ; port SAI_1/5.SAI1_RXFS
SAI1_TXC: U1.AJ12(SAI1_TXC) ; port SAI_1/5.SAI1_TXC
SAI1_TXD0: U1.AJ11(SAI1_TXD0) ; port SAI_1/5.SAI1_TXD0
SAI1_TXD1: U1.AJ10(SAI1_TXD1) ; port SAI_1/5.SAI1_TXD1
SAI1_TXD2: U1.AH11(SAI1_TXD2) ; port SAI_1/5.SAI1_TXD2
SAI1_TXD3: U1.AD12(SAI1_TXD3) ; port SAI_1/5.SAI1_TXD3
SAI1_TXD4: U1.AH13(SAI1_TXD4) ; port SAI_1/5.SAI1_TXD4
SAI1_TXD5: U1.AH14(SAI1_TXD5) ; port SAI_1/5.SAI1_TXD5
SAI1_TXD6: U1.AC12(SAI1_TXD6) ; port SAI_1/5.SAI1_TXD6
SAI1_TXD7: U1.AJ13(SAI1_TXD7) ; port SAI_1/5.SAI1_TXD7
SAI1_TXFS: U1.AF12(SAI1_TXFS) ; port SAI_1/5.SAI1_TXFS
SAI2_MCLK: U1.AJ15(SAI2_MCLK) ; port SAI_2/3.SAI2_MCLK
SAI2_RXC: U1.AJ16(SAI2_RXC) ; port SAI_2/3.SAI2_RXC
SAI2_RXD: U1.AJ14(SAI2_RXD0) ; port SAI_2/3.SAI2_RXD
SAI2_RXFS: U1.AH17(SAI2_RXFS) ; port SAI_2/3.SAI2_RXFS
SAI2_TXC: U1.AH15(SAI2_TXC) ; port SAI_2/3.SAI2_TXC
SAI2_TXD: U1.AH16(SAI2_TXD0) ; port SAI_2/3.SAI2_TXD
SAI2_TXFS: U1.AJ17(SAI2_TXFS) ; port SAI_2/3.SAI2_TXFS
SAI3_MCLK: U1.AJ20(SAI3_MCLK) ; port SAI_2/3.SAI3_MCLK
SAI3_RXC: U1.AJ18(SAI3_RXC) ; port SAI_2/3.SAI3_RXC
SAI3_RXD: U1.AF18(SAI3_RXD) ; port SAI_2/3.SAI3_RXD
SAI3_RXFS: U1.AJ19(SAI3_RXFS) ; port SAI_2/3.SAI3_RXFS
SAI3_TXC: U1.AH19(SAI3_TXC) ; port SAI_2/3.SAI3_TXC
SAI3_TXD: U1.AH18(SAI3_TXD) ; port SAI_2/3.SAI3_TXD
SAI3_TXFS: U1.AC16(SAI3_TXFS) ; port SAI_2/3.SAI3_TXFS
SAI5_MCLK: U1.AF14(SAI5_MCLK) ; port SAI_1/5.SAI5_MCLK
SAI5_RXC: U1.AD14(SAI5_RXC) ; port SAI_1/5.SAI5_RXC
SAI5_RXD0: U1.AE16(SAI5_RXD0) ; port SAI_1/5.SAI5_RXD0
SAI5_RXD1: U1.AD16(SAI5_RXD1) ; port SAI_1/5.SAI5_RXD1
SAI5_RXD2: U1.AF16(SAI5_RXD2) ; port SAI_1/5.SAI5_RXD2
SAI5_RXD3: U1.AE14(SAI5_RXD3) ; port SAI_1/5.SAI5_RXD3
SAI5_RXFS: U1.AC14(SAI5_RXFS) ; port SAI_1/5.SAI5_RXFS
SD1_CLK: U1.W28(SD1_CLK) ; port SD1.SD1_CLK
SD1_CMD: U1.W29(SD1_CMD) ; port SD1.SD1_CMD
SD1_DATA0: U1.Y29(SD1_DATA0) ; port SD1.SD1_DATA0
SD1_DATA1: U1.Y28(SD1_DATA1) ; port SD1.SD1_DATA1
SD1_DATA2: U1.V29(SD1_DATA2) ; port SD1.SD1_DATA2
SD1_DATA3: U1.V28(SD1_DATA3) ; port SD1.SD1_DATA3
SD1_DATA4: U1.U26(SD1_DATA4) ; port SD1.SD1_DATA4
SD1_DATA5: U1.AA29(SD1_DATA5) ; port SD1.SD1_DATA5
SD1_DATA6: U1.AA28(SD1_DATA6) ; port SD1.SD1_DATA6
SD1_DATA7: U1.U25(SD1_DATA7) ; port SD1.SD1_DATA7
SD1_RESET_B: U1.W25(SD1_RESET_B) ; port SD1.SD1_RESET_B
SD1_STROBE: U1.W26(SD1_STROBE) ; port SD1.SD1_STROBE
SD2_CLK: U1.AB29(SD2_CLK) ; port SD2.SD2_CLK
SD2_CMD: R23.2 U1.AB28(SD2_CMD) ; port SD2.SD2_CMD
SD2_DATA0: R22.2 U1.AC28(SD2_DATA0) ; port SD2.SD2_DATA0
SD2_DATA1: U1.AC29(SD2_DATA1) ; port SD2.SD2_DATA1
SD2_DATA2: U1.AA26(SD2_DATA2) ; port SD2.SD2_DATA2
SD2_DATA3: U1.AA25(SD2_DATA3) ; port SD2.SD2_DATA3
SD2_nCD: U1.AD29(SD2_CD_B) ; port SD2.SD2_nCD
SD2_RESET_B: R24.2
SD2_VSEL: U1.E6(GPIO1_IO04) ; port SD2_VSEL
SD2_WP: U1.AC26(SD2_WP) ; port SD2.SD2_WP
SD3_CLK: U1.U28(NAND_WE_B) ; port eMMC_QSPI.SD3_CLK
SD3_CMD: U1.U29(NAND_WP_B) ; port eMMC_QSPI.SD3_CMD
SD3_DATA0: U1.P29(NAND_DATA04) ; port eMMC_QSPI.SD3_DATA0
SD3_DATA1: U1.N29(NAND_DATA05) ; port eMMC_QSPI.SD3_DATA1
SD3_DATA2: U1.M29(NAND_DATA06) ; port eMMC_QSPI.SD3_DATA2
SD3_DATA3: U1.R29(NAND_DATA07) ; port eMMC_QSPI.SD3_DATA3
SD3_DATA4: U1.R28(NAND_RE_B) ; port eMMC_QSPI.SD3_DATA4
SD3_DATA5: U1.P28(NAND_CE2_B) ; port eMMC_QSPI.SD3_DATA5
SD3_DATA6: U1.N28(NAND_CE3_B) ; port eMMC_QSPI.SD3_DATA6
SD3_DATA7: U1.M28(NAND_CLE) ; port eMMC_QSPI.SD3_DATA7
SD3_STROBE: U1.T29(NAND_CE1_B) ; port eMMC_QSPI.SD3_STROBE
SPDIF_EXT_CLK: U1.AC18(SPDIF_EXT_CLK) ; port SAI_2/3.SPDIF_EXT_CLK
SPDIF_RX: U1.AD18(SPDIF_RX) ; port SAI_2/3.SPDIF_RX
SPDIF_TX: U1.AE18(SPDIF_TX) ; port SAI_2/3.SPDIF_TX
SYS_STATUS: Q1.G U1.T28(NAND_READY_B) ; port eMMC_QSPI.SYS_STATUS
UART1_CTS: U1.AE6(UART3_RXD) ; port UART1_CTS
UART1_RTS: U1.AJ4(UART3_TXD) ; port UART1_RTS
UART1_RXD: U1.AD6(UART1_RXD) ; port UART1_RXD
UART1_TXD: U1.AJ3(UART1_TXD) ; port UART1_TXD
UART3_CTS: U1.AD20(ECSPI1_MISO) ; port UART3_CTS
UART3_RTS: U1.AE20(ECSPI1_SS0) ; port UART3_RTS
UART3_RXD: U1.AF20(ECSPI1_SCLK) ; port UART3_RXD
UART3_TXD: U1.AC20(ECSPI1_MOSI) ; port UART3_TXD
WDOG_B: U1.B6(GPIO1_IO02) ; port WDOG_B
NetD1_1: D1.1(C) Q1.D
NetD1_2: D1.2(A) R15.1
NetR14_2: R14.2 ; port eMMC_QSPI.QSPIA_DQS

Not connected (* = marked no-connect by the designer): U1 AD28(SD2_RESET_B)*

### Layout directives
net class I2C: I2C1_SCL, I2C1_SDA, I2C2_SCL, I2C2_SDA, I2C3_SCL, I2C3_SDA, I2C4_SCL, I2C4_SDA

### Notes on the sheet
- CPU IO
- This port can be used as a GPIO Port
- DO NOT USE
- (near C70) DNP
- For QSPI High Speed Operation, use dummy DQS generated by FlexSPI controller and looped back through the DQS pad.
  Use 10-18pF cap load on DQS to compensate SIO/SCK pins load.
- BT
- A53 Debug
- M7 Debug
- (near TP20) Configure internal pull up at CPU side, open drain output
  Configure internal pull up at CPU side
- (near Q1) Blink:  SYS_STATUS
- DNP
- (near R24) External PU is necessary for SD2_RESET_B to enable SD card power as default!
- PCB Des :
- Approv By :
- Project Title :
- Sheet Title :
- Date :
- Page :
- PCB Version :
- PCB Revision :
- Size :
- A2
- (in symbol IC_MPU_8M_PLUS_MIMX8ML8DVNLZAB, part H) i.MX8MP - SAI
- (in symbol IC_MPU_8M_PLUS_MIMX8ML8DVNLZAB, part I) i.MX8MP - NAND
- (in symbol IC_MPU_8M_PLUS_MIMX8ML8DVNLZAB, part J) i.MX8MP - SD
- (in symbol IC_MPU_8M_PLUS_MIMX8ML8DVNLZAB, part K) i.MX8MP - eNET
- (in symbol IC_MPU_8M_PLUS_MIMX8ML8DVNLZAB, part L) i.MX8MP - Peri; NVCC_GPIO1

### Library data of the parts
C70 = CAP_18PF_50V_NP0_0201: Multilayer Ceramic Capacitor, 18 pF, 50 V, ± 5%, C0G (NP0), 0201 [0603 Metric]; Manufacturer: Murata; Temperature Coefficient: 30ppm/°C; Supplier 1: Digikey; Manufacturer Part Number: GRM0335C1H180JA01D; RoHS: Yes; Category: Ceramic Capacitors; Stock 1: 464126; Pricing 1: 1=0.1, 10=0.011, 50=0.0062, 100=0.0048, 500=0.0036, 1000=0.00283, 2500=0.00258, 5000=0.00237 (USD); Mount: Surface Mount; Case Code (Metric): 0603; Case Code (Imperial): 0201; Material: Ceramic; Min Operating Temperature: -55°C; Max Operating Temperature: 125°C; Package Quantity: 15000; Packaging: Tape and Reel; Voltage Rating (DC): 50V; Termination: SMD/SMT; Series: GRM; Dielectric: C0G; Tolerance: 5%; Voltage: 50V; Length: 0.6mm; Width: 0.3mm; Height: 0.3mm; Depth: 0.3mm; Radiation Hardening: No; RoHS Compliant: Yes; Lead Free: Lead Free; Supplier Part Number 1: 490-6117-1-ND
D1 = LED_DIO_GREEN_20mA_0603: LTST-C191KGKT Lite-On LED, green, 18-71mcd, 130, 1.9V-2.4V SMD, 0603 1.6x0.8x0.55mm RoHS; Manufacturer: Vishay Lite-On; Lens Color: Colorless; Luminous Intensity: 35mcd; Viewing Angle: 130°; Forward Voltage: 2V; Dominant Wavelength: 571nm; Lens Transparency: Clear; Wavelength: 574nm; Lens Style: Flat,Rectangular,Colorless; Number of LEDs: 1; Max Power Dissipation: 75mW; Lens Size: 0.8mm; Supplier 1: Digi-Key; Manufacturer Part Number: LTST-C191KGKT; RoHS: Yes; Stock 1: 1556161; Pricing 1: 1=0.26, 10=0.143, 100=0.0663, 500=0.0612, 1000=0.04794, 2000=0.04693 (USD); Mount: Surface Mount; Number of Pins: 2; Color: Green; Case Code (Metric): 1608; Case Code (Imperial): 0603; Min Operating Temperature: -55°C; Max Operating Temperature: 85°C; Packaging: Tape and Reel; Series: -; Length: 1.6mm; Width: 0.8mm; Height: 0.65mm; RoHS Compliant: Yes; Lead Free: Lead Free; ComponentLink1URL: https://datasheet.ciiva.com/2109/ltst-c191kgkt-2109973.pdf?src-supplier=Digi-Key; ComponentLink1Description: https://datasheet.ciiva.com/2109/ltst-c191kgkt-2109973.pdf?src-supplier=Digi-Key; Supplier Part Number 1: 160-1446-1-ND
Q1 = TRANS_FET_CHA_N_60V_340mA: N-Channel Enhancement Mode MOSFET 60V 340mA 3-Pin SOT-323 T/R; Manufacturer: Diodes; Continuous Drain Current (ID): 400mA; Rds On Max: 2R; Input Capacitance: 28.5pF; Max Power Dissipation: 440mW; Supplier 1: Digi-Key; Manufacturer Part Number: DMN61D9UWQ-13; RoHS: Yes; Category: MOSFETs; Stock 1: 209235; Pricing 1: 1=0.35, 10=0.259, 100=0.1468, 500=0.0972, 1000=0.07452, 2000=0.0648, 5000=0.05832 (USD); Mount: Surface Mount; Case/Package: SOT-323; Min Operating Temperature: -55°C; Max Operating Temperature: 150°C; Packaging: Cut Tape; Drain to Source Voltage (Vdss): 60V; Series: -; RoHS Compliant: Yes; ComponentLink1URL: https://www.diodes.com/assets/Datasheets/DMN61D9UWQ.pdf?src-supplier=Digi-Key; ComponentLink1Description: https://www.diodes.com/assets/Datasheets/DMN61D9UWQ.pdf?src-supplier=Digi-Key; ComponentLink2URL: https://datasheet.octopart.com/DMN61D9UWQ-13-Diodes-Inc.-datasheet-151210411.pdf?src-supplier=Farnell; ComponentLink2Description: https://datasheet.octopart.com/DMN61D9UWQ-13-Diodes-Inc.-datasheet-151210411.pdf?src-supplier=Farnell; ComponentLink3URL: https://datasheet.octopart.com/DMN61D9UWQ-13-Diodes-Inc.-datasheet-165191130.pdf?src-supplier=Future+Electronics; ComponentLink3Description: https://datasheet.octopart.com/DMN61D9UWQ-13-Diodes-Inc.-datasheet-165191130.pdf?src-supplier=Future+Electronics; Supplier Part Number 1: DMN61D9UWQ-13DICT-ND
R14 = RES_0R_5%_100mW_0402: SMD Chip Resistor, Jumper, 0 ohm, 100 mW, 0402 [1005 Metric], Thick Film, General Purpose; Manufacturer: Panasonic; Power Rating: 100mW; Voltage Rating: 50V; Temperature Coefficient: 600ppm/°C; Supplier 1: Mouser; Manufacturer Part Number: ERJ-2GE0R00X; RoHS: Yes; Category: Chip SMD Resistors; Stock 1: 10989354; Pricing 1: 1=0.1, 10=0.013, 50=0.013, 100=0.006, 1000=0.004, 2500=0.003, 10000=0.003 (USD); Mount: Surface Mount; Case/Package: 0402; Contact Plating: Tin; Case Code (Metric): 1005; Size Code: 0402; Min Operating Temperature: -55°C; Max Operating Temperature: 155°C; Resistor Type: Thick Film; Packaging: Cut Tape; Package Quantity: 10000; Number of Terminations: 2; Termination: SMD/SMT; Max Power Dissipation: 100mW; Voltage Rating (DC): 50V; Features: Automotive AEC-Q200; Series: ERJ; Construction: Rectangular; Technology: THICK FILM; Length: 1mm; Width: 0.5mm; Height: 0.35mm; Depth: 0.5mm; Ratings: AEC-Q200; Radiation Hardening: No; Reach SVHC Compliant: No; Military Standard: Not; Lead Free: Lead Free; RoHS Compliant: Yes; ComponentLink1URL: https://datasheet.ciiva.com/11821/0900766b80f806dd-11821176.pdf?src-supplier=Rs; ComponentLink1Description: https://datasheet.ciiva.com/11821/0900766b80f806dd-11821176.pdf?src-supplier=Rs; ComponentLink2URL: https://datasheet.ciiva.com/43460/1678796-43460347.pdf?src-supplier=Farnell; ComponentLink2Description: https://datasheet.ciiva.com/43460/1678796-43460347.pdf?src-supplier=Farnell; ComponentLink3URL: https://datasheet.ciiva.com/46389/1678796-46389518.pdf?src-supplier=Element14; ComponentLink3Description: https://datasheet.ciiva.com/46389/1678796-46389518.pdf?src-supplier=Element14; ComponentLink4URL: https://datasheet.ciiva.com/5959/1678796-5959692.pdf?src-supplier=Farnell; ComponentLink4Description: https://datasheet.ciiva.com/5959/1678796-5959692.pdf?src-supplier=Farnell; ComponentLink5URL: https://datasheet.ciiva.com/28695/1678796-28695758.pdf?src-supplier=Element14; ComponentLink5Description: https://datasheet.ciiva.com/28695/1678796-28695758.pdf?src-supplier=Element14; ComponentLink6URL: https://datasheet.ciiva.com/16783/70260739-16783734.pdf?src-supplier=Allied+Electronics; ComponentLink6Description: https://datasheet.ciiva.com/16783/70260739-16783734.pdf?src-supplier=Allied+Electronics; ComponentLink7URL: https://datasheet.ciiva.com/16778/70260739-16778335.pdf?src-supplier=Allied+Electronics; ComponentLink7Description: https://datasheet.ciiva.com/16778/70260739-16778335.pdf?src-supplier=Allied+Electronics; ComponentLink8URL: https://datasheet.ciiva.com/48531/aoa0000ce1-48531077.pdf?src-supplier=Avnet; ComponentLink8Description: https://datasheet.ciiva.com/48531/aoa0000ce1-48531077.pdf?src-supplier=Avnet; ComponentLink9URL: https://datasheet.ciiva.com/30097/4aoa0000ce1-30097116.pdf?src-supplier=Onlinecomponents.com; ComponentLink9Description: https://datasheet.ciiva.com/30097/4aoa0000ce1-30097116.pdf?src-supplier=Onlinecomponents.com; Supplier Part Number 1: 667-ERJ-2GE0R00X
R15 = RES_1K_1%_100mW_0402: RES SMD 1K OHM 1% 1/10W 0402; Manufacturer: Panasonic; Temperature Coefficient: 100ppm/°C; Max Power Dissipation: 100mW; Voltage Rating (DC): 50V; Supplier 1: Digi-Key; Manufacturer Part Number: ERJ-2RKF1001X; RoHS: Yes; Category: Chip SMD Resistors; Stock 1: 2367361; Pricing 1: 1=0.1, 10=0.029, 50=0.0162, 100=0.0119, 500=0.00728, 1000=0.00535, 5000=0.00384 (USD); Mount: Surface Mount; Number of Pins: 2; Case Code (Imperial): 0402; Case Code (Metric): 1005; Contact Plating: Tin; Min Operating Temperature: -55°C; Max Operating Temperature: 155°C; Packaging: Tape and Reel; Number of Terminations: 2; Features: Automotive AEC-Q200; Voltage Rating: 50V; Power Rating: 100mW; Package Quantity: 1; Termination: SMD/SMT; Resistor Type: Thick Film; Series: ERJ; Resistance Tolerance: 1%; Construction: Rectangular; Technology: THICK FILM; Length: 1mm; Width: 0.5mm; Height: 0.35mm; Depth: 0.5mm; Lead Free: Lead Free; RoHS Compliant: Yes; Reach SVHC Compliant: Yes; Military Standard: Not; Supplier Part Number 1: P1.00KLCT-ND
R16-R21 R24 = RES_4.7K_5%_50mW_0201: Res Thick Film 0201 4.7K Ohm 5% 0.05W(1/20W) ±200ppm/C Pad SMD Automotive T/R; Manufacturer: KOA Speer; Power Rating: 50mW; Voltage Rating: 25V; Temperature Coefficient: 200ppm/°C; Supplier 1: Digikey; Manufacturer Part Number: RK73B1HTTC472J; RoHS: Yes; Category: Chip SMD Resistors; Stock 1: 410528; Pricing 1: 1=0.1, 10=0.033, 50=0.021, 100=0.0177, 500=0.01224, 1000=0.0106, 5000=0.00782 (USD); Case Code (Imperial): 0201; Case Code (Metric): 0603; Min Operating Temperature: -55°C; Max Operating Temperature: 125°C; Packaging: Tape and Reel; Termination: SMD/SMT; Voltage Rating (DC): 25V; Series: RK73B; Construction: Rectangular; Length: 0.6mm; Depth: 0.3mm; Military Standard: Not; Lead Free: Lead Free; RoHS Compliant: Yes; ComponentLink1URL: https://datasheet.ciiva.com/5556/rk73b-5556381.pdf?src-supplier=Mouser; ComponentLink1Description: https://datasheet.ciiva.com/5556/rk73b-5556381.pdf?src-supplier=Mouser; Supplier Part Number 1: 2019-RK73B1HTTC472JDKR-ND
R22 R23 = RES_10K_1/12W_1%_0201: SMD Chip Resistor, 10 kOhm, ± 1%, 50 mW, 0201 [0603 Metric], Thick Film, General Purpose; Manufacturer: Yageo; Temperature Coefficient: 200ppm/°C; Power Rating: 50mW; Voltage Rating: 25V; Supplier 1: Digikey; Manufacturer Part Number: RC0201FR-0710KL; RoHS: Yes; Category: Chip SMD Resistors; Stock 1: 12030325; Pricing 1: 1=0.1, 10=0.027, 50=0.0172, 100=0.0143, 500=0.00988, 1000=0.00854, 5000=0.00629 (USD); Case/Package: 0201; Number of Pins: 2NUMBER; Contact Plating: Tin,Matte; Case Code (Metric): 0603; Weight: 6E-06oz; Min Operating Temperature: -55°C; Max Operating Temperature: 125°C; Packaging: Tape and Reel; Package Quantity: 10000; Termination: SMD/SMT; Resistor Type: Thick Film; Series: RC; Number of Terminations: 2; Max Power Dissipation: 50mW; Working Voltage: 25V; Features: Moisture Resistant; Technology: THICK FILM; Resistance Tolerance: 1%; Construction: Rectangular; Voltage Rating (DC): 25V; Length: 0.6mm; Width: 0.012inch; Height: 0.01inch; Depth: 0.3mm; RoHS Compliant: Yes; Reach SVHC Compliant: No; Military Standard: Not; Lead Free: 5697LeadFree; ComponentLink1URL: https://datasheet.ciiva.com/7660/1421516-7660807.pdf?src-supplier=Element14; ComponentLink1Description: https://datasheet.ciiva.com/7660/1421516-7660807.pdf?src-supplier=Element14; ComponentLink2URL: https://datasheet.ciiva.com/46391/1421516-46391339.pdf?src-supplier=Element14; ComponentLink2Description: https://datasheet.ciiva.com/46391/1421516-46391339.pdf?src-supplier=Element14; ComponentLink3URL: https://datasheet.ciiva.com/2467/pyu-r-int-thick-7-2467110.pdf?src-supplier=Digikey; ComponentLink3Description: https://datasheet.ciiva.com/2467/pyu-r-int-thick-7-2467110.pdf?src-supplier=Digikey; ComponentLink4URL: https://datasheet.ciiva.com/2467/pyu-r-int-thick-7-2467111.pdf?src-supplier=Digikey; ComponentLink4Description: https://datasheet.ciiva.com/2467/pyu-r-int-thick-7-2467111.pdf?src-supplier=Digikey; ComponentLink5URL: https://datasheet.ciiva.com/2467/pyu-r-int-thick-7-2467109.pdf?src-supplier=Digikey; ComponentLink5Description: https://datasheet.ciiva.com/2467/pyu-r-int-thick-7-2467109.pdf?src-supplier=Digikey; ComponentLink6URL: https://datasheet.ciiva.com/26829/getdatasheetpartid-421074-26829851.pdf?src-supplier=Verical; ComponentLink6Description: https://datasheet.ciiva.com/26829/getdatasheetpartid-421074-26829851.pdf?src-supplier=Verical; ComponentLink7URL: https://datasheet.ciiva.com/8891/pyu-rc0201-51-rohs-l-8-8891384.pdf?src-supplier=Avnet; ComponentLink7Description: https://datasheet.ciiva.com/8891/pyu-rc0201-51-rohs-l-8-8891384.pdf?src-supplier=Avnet; Supplier Part Number 1: 311-10.0KMCT-ND
TP20 = TP_PAD_SMD_SMALL: Test Point, SMD pad, round, 1.5mm, 1.6mm, 3mm diameter
U1 = IC_MPU_8M_PLUS_MIMX8ML8DVNLZAB: i.MX 8M Plus, Consumer, / TRAY TRAY MULTIPLE DP BAKEABLE RoHS Compliant: Yes; Manufacturer: NXP Semiconductors; Supplier 1: Arrow Electronics; Manufacturer Part Number: MIMX8ML8DVNLZAB; RoHS: Yes; Category: Microprocessors; Stock 1: 1036; Pricing 1: 1=54.8, 5=52.24, 10=44.19, 25=42.8, 50=39.95, 100=31.83 (USD); Supplier Part Number 1: MIMX8ML8DVNLZAB

## Sheet CPU PHY.SchDoc: CPU PHY
size A2; DrawnBy: ELIO F.; Engineer: ELIO F.; Revision: A; SheetNumber: 6; SheetTotal: 20
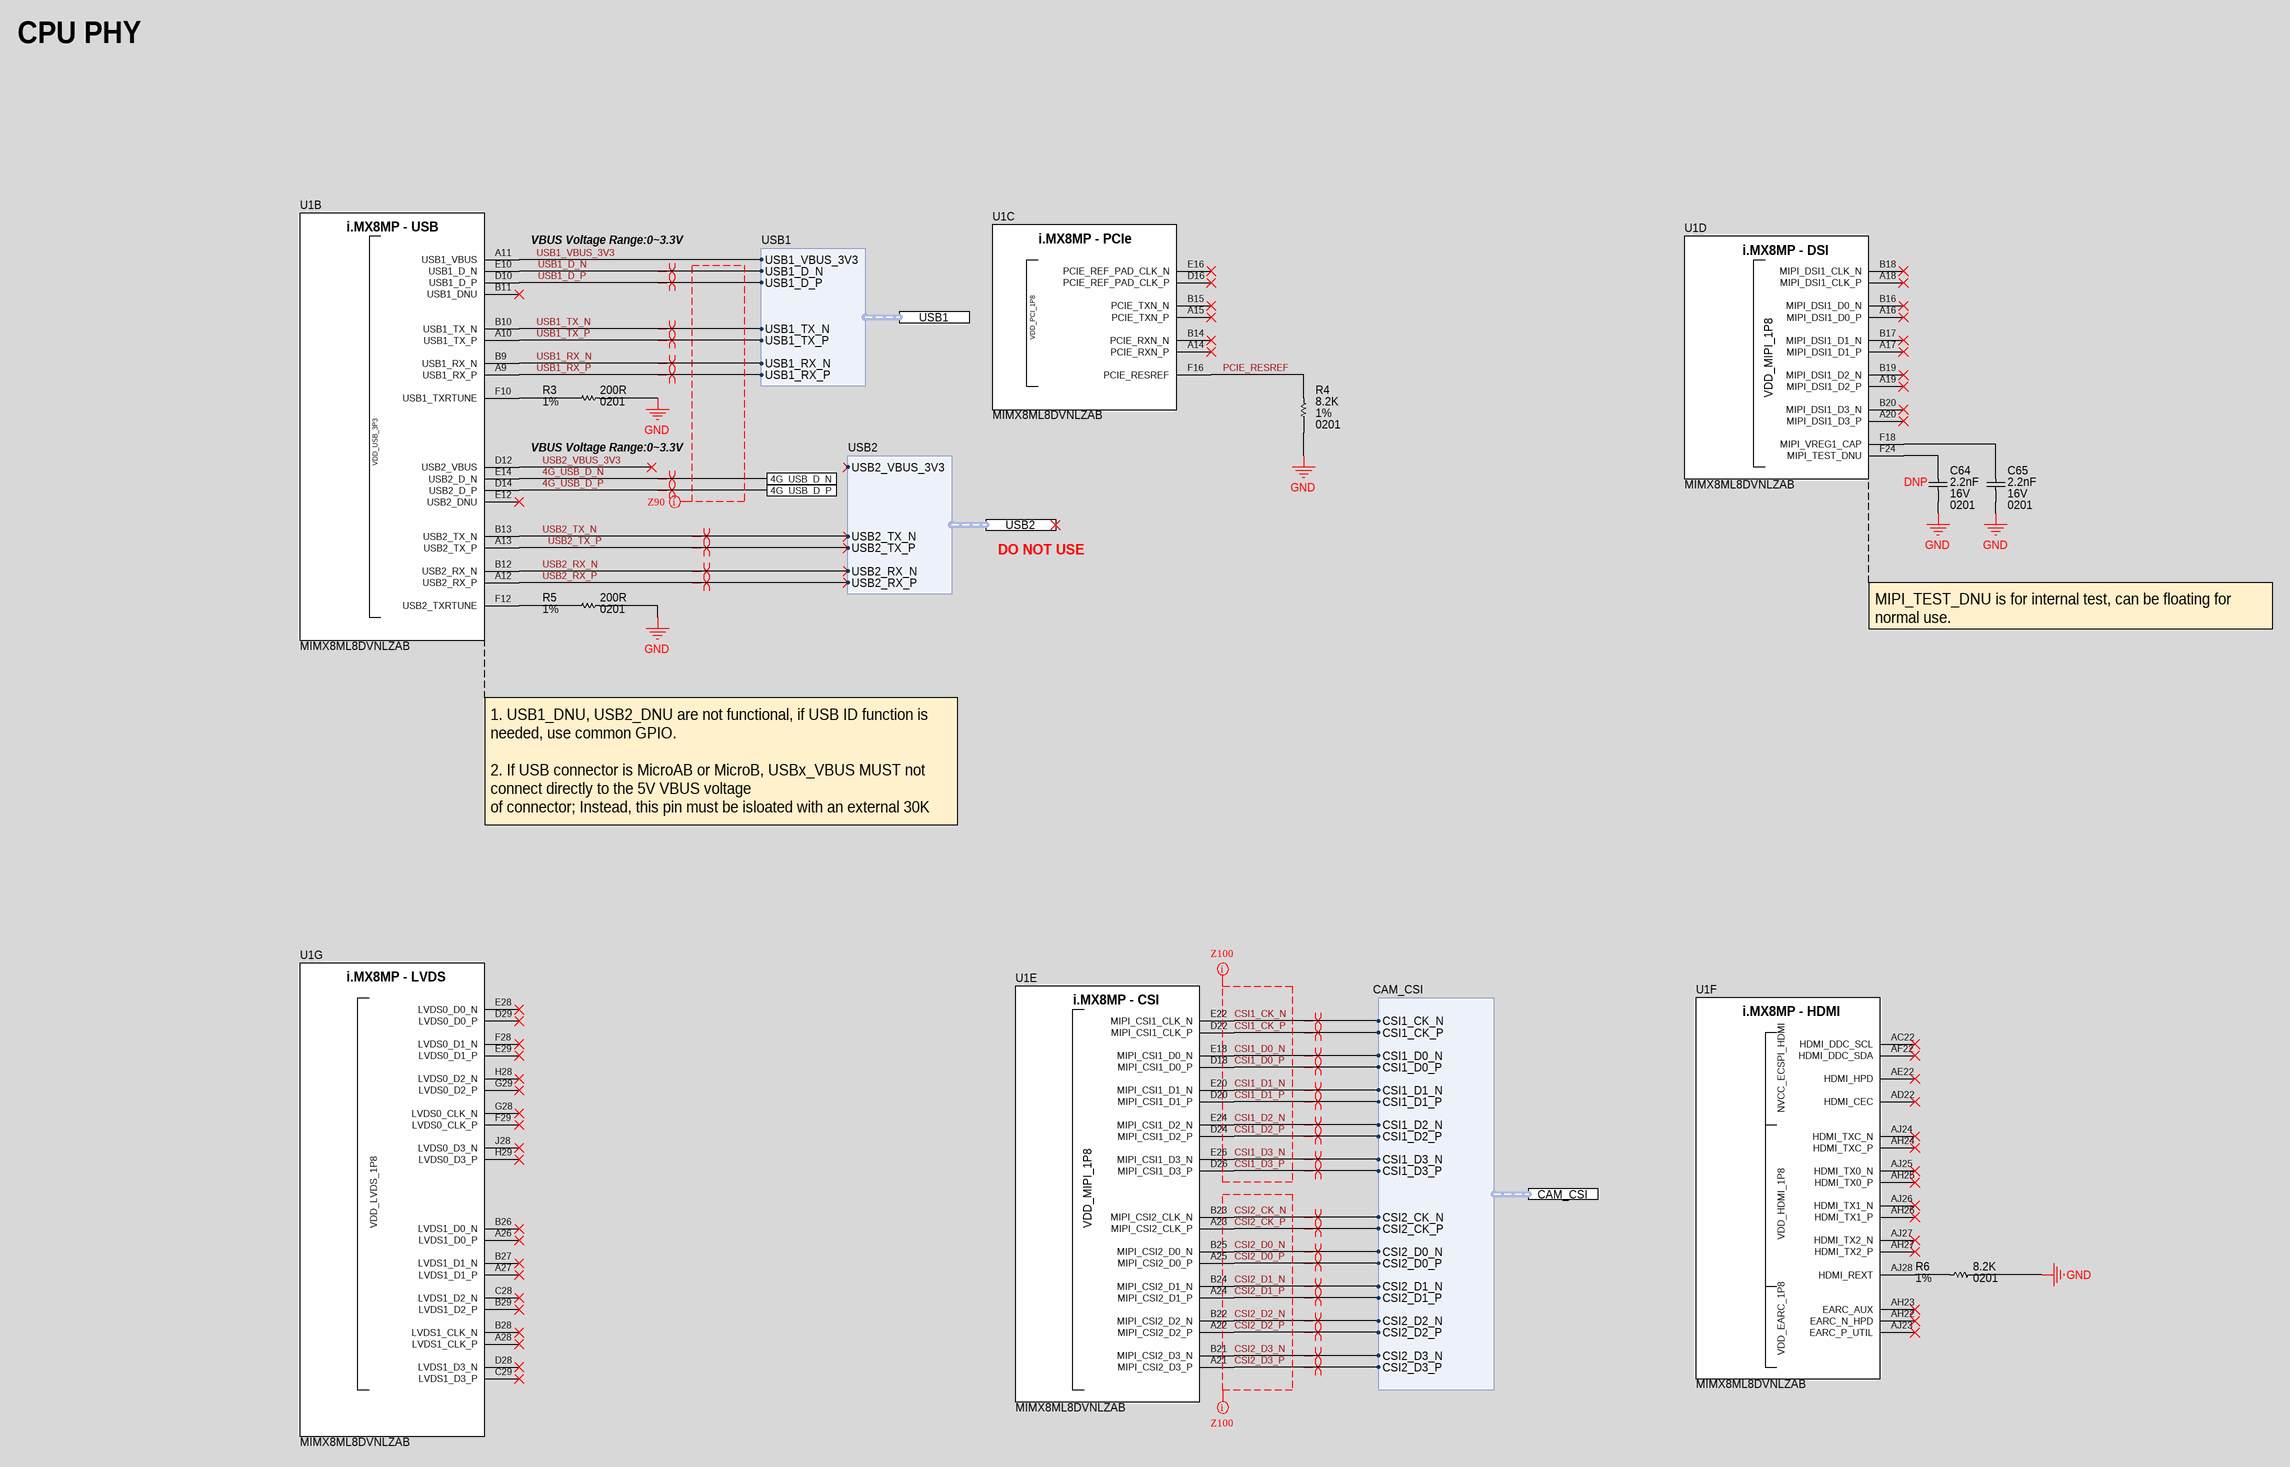
[diagram p6: CPU PHY.SchDoc]

### Parts
C64  Voltage Rating: 16V  Capacitance: 2.2nF  Case/Package: 0201  [CAP_0201_CAPC0603X03N]  (hidden comment: GRM033R71C222KA88D)
C65  Voltage Rating: 16V  Capacitance: 2.2nF  Case/Package: 0201  [CAP_0201_CAPC0603X03N]  (hidden comment: GRM033R71C222KA88D)
R3  Tolerance: 1%  Resistance: 200R  Case/Package: 0201  [RES_0201_RESC0603X02N]  (hidden comment: RC0201FR-07200RL)
R4  Tolerance: 1%  Resistance: 8.2K  Case/Package: 0201  [RES_0201_RESC0603X02N]  (hidden comment: RC0201FR-078K2L)
R5  Tolerance: 1%  Resistance: 200R  Case/Package: 0201  [RES_0201_RESC0603X02N]  (hidden comment: RC0201FR-07200RL)
R6  Tolerance: 1%  Resistance: 8.2K  Case/Package: 0201  [RES_0201_RESC0603X02N]  (hidden comment: RC0201FR-078K2L)
U1  MIMX8ML8DVNLZAB  [IC_MPU_BGA548C50P29X29_1500X1500X148]  (parts B,C,D,E,F,G of 15)

### Ports
4G_USB_D_N, 4G_USB_D_P, CAM_CSI (harness CAM_CSI), USB1 (harness USB1), USB2 (harness USB2)

### Harnesses
USB1: USB1_VBUS_3V3, USB1_D_N, USB1_D_P, USB1_TX_N, USB1_TX_P, USB1_RX_N, USB1_RX_P
CAM_CSI: CSI1_CK_N, CSI1_CK_P, CSI1_D0_N, CSI1_D0_P, CSI1_D1_N, CSI1_D1_P, CSI1_D2_N, CSI1_D2_P, CSI1_D3_N, CSI1_D3_P, CSI2_CK_N, CSI2_CK_P, CSI2_D0_N, CSI2_D0_P, CSI2_D1_N, CSI2_D1_P, CSI2_D2_N, CSI2_D2_P, CSI2_D3_N, CSI2_D3_P
USB2: USB2_VBUS_3V3, USB2_TX_N, USB2_TX_P, USB2_RX_N, USB2_RX_P

### Nets
GND: C64.1 C65.1 R3.2 R4.1 R5.2 R6.1
4G_USB_D_N: U1.E14(USB2_D_N) ; port 4G_USB_D_N
4G_USB_D_P: U1.D14(USB2_D_P) ; port 4G_USB_D_P
CSI1_CK_N: U1.E22(MIPI_CSI1_CLK_N) ; port CAM_CSI.CSI1_CK_N
CSI1_CK_P: U1.D22(MIPI_CSI1_CLK_P) ; port CAM_CSI.CSI1_CK_P
CSI1_D0_N: U1.E18(MIPI_CSI1_D0_N) ; port CAM_CSI.CSI1_D0_N
CSI1_D0_P: U1.D18(MIPI_CSI1_D0_P) ; port CAM_CSI.CSI1_D0_P
CSI1_D1_N: U1.E20(MIPI_CSI1_D1_N) ; port CAM_CSI.CSI1_D1_N
CSI1_D1_P: U1.D20(MIPI_CSI1_D1_P) ; port CAM_CSI.CSI1_D1_P
CSI1_D2_N: U1.E24(MIPI_CSI1_D2_N) ; port CAM_CSI.CSI1_D2_N
CSI1_D2_P: U1.D24(MIPI_CSI1_D2_P) ; port CAM_CSI.CSI1_D2_P
CSI1_D3_N: U1.E26(MIPI_CSI1_D3_N) ; port CAM_CSI.CSI1_D3_N
CSI1_D3_P: U1.D26(MIPI_CSI1_D3_P) ; port CAM_CSI.CSI1_D3_P
CSI2_CK_N: U1.B23(MIPI_CSI2_CLK_N) ; port CAM_CSI.CSI2_CK_N
CSI2_CK_P: U1.A23(MIPI_CSI2_CLK_P) ; port CAM_CSI.CSI2_CK_P
CSI2_D0_N: U1.B25(MIPI_CSI2_D0_N) ; port CAM_CSI.CSI2_D0_N
CSI2_D0_P: U1.A25(MIPI_CSI2_D0_P) ; port CAM_CSI.CSI2_D0_P
CSI2_D1_N: U1.B24(MIPI_CSI2_D1_N) ; port CAM_CSI.CSI2_D1_N
CSI2_D1_P: U1.A24(MIPI_CSI2_D1_P) ; port CAM_CSI.CSI2_D1_P
CSI2_D2_N: U1.B22(MIPI_CSI2_D2_N) ; port CAM_CSI.CSI2_D2_N
CSI2_D2_P: U1.A22(MIPI_CSI2_D2_P) ; port CAM_CSI.CSI2_D2_P
CSI2_D3_N: U1.B21(MIPI_CSI2_D3_N) ; port CAM_CSI.CSI2_D3_N
CSI2_D3_P: U1.A21(MIPI_CSI2_D3_P) ; port CAM_CSI.CSI2_D3_P
PCIE_RESREF: R4.2 U1.F16(PCIE_RESREF)
USB1_D_N: U1.E10(USB1_D_N) ; port USB1.USB1_D_N
USB1_D_P: U1.D10(USB1_D_P) ; port USB1.USB1_D_P
USB1_RX_N: U1.B9(USB1_RX_N) ; port USB1.USB1_RX_N
USB1_RX_P: U1.A9(USB1_RX_P) ; port USB1.USB1_RX_P
USB1_TX_N: U1.B10(USB1_TX_N) ; port USB1.USB1_TX_N
USB1_TX_P: U1.A10(USB1_TX_P) ; port USB1.USB1_TX_P
USB1_VBUS_3V3: U1.A11(USB1_VBUS) ; port USB1.USB1_VBUS_3V3
USB2_RX_N: U1.B12(USB2_RX_N) ; port USB2.USB2_RX_N
USB2_RX_P: U1.A12(USB2_RX_P) ; port USB2.USB2_RX_P
USB2_TX_N: U1.B13(USB2_TX_N) ; port USB2.USB2_TX_N
USB2_TX_P: U1.A13(USB2_TX_P) ; port USB2.USB2_TX_P
USB2_VBUS_3V3: U1.D12(USB2_VBUS)
NetC64_2: C64.2 U1.F24(MIPI_TEST_DNU)
NetC65_2: C65.2 U1.F18(MIPI_VREG1_CAP)
NetR3_1: R3.1 U1.F10(USB1_TXRTUNE)
NetR5_1: R5.1 U1.F12(USB2_TXRTUNE)
NetR6_2: R6.2 U1.AJ28(HDMI_REXT)

Not connected (* = marked no-connect by the designer): U1 A14(PCIE_RXN_P)* A15(PCIE_TXN_P)* A16(MIPI_DSI1_D0_P)* A17(MIPI_DSI1_D1_P)* A18(MIPI_DSI1_CLK_P)* A19(MIPI_DSI1_D2_P)* A20(MIPI_DSI1_D3_P)* A26(LVDS1_D0_P)* A27(LVDS1_D1_P)* A28(LVDS1_CLK_P)* AC22(HDMI_DDC_SCL)* AD22(HDMI_CEC)* AE22(HDMI_HPD)* AF22(HDMI_DDC_SDA)* AH22(EARC_N_HPD)* AH23(EARC_AUX)* AH24(HDMI_TXC_P)* AH25(HDMI_TX0_P)* AH26(HDMI_TX1_P)* AH27(HDMI_TX2_P)* AJ23(EARC_P_UTIL)* AJ24(HDMI_TXC_N)* AJ25(HDMI_TX0_N)* AJ26(HDMI_TX1_N)* AJ27(HDMI_TX2_N)* B11(USB1_DNU)* B14(PCIE_RXN_N)* B15(PCIE_TXN_N)* B16(MIPI_DSI1_D0_N)* B17(MIPI_DSI1_D1_N)* B18(MIPI_DSI1_CLK_N)* B19(MIPI_DSI1_D2_N)* B20(MIPI_DSI1_D3_N)* B26(LVDS1_D0_N)* B27(LVDS1_D1_N)* B28(LVDS1_CLK_N)* B29(LVDS1_D2_P)* C28(LVDS1_D2_N)* C29(LVDS1_D3_P)* D16(PCIE_REF_PAD_CLK_P)* D28(LVDS1_D3_N)* D29(LVDS0_D0_P)* E12(USB2_DNU)* E16(PCIE_REF_PAD_CLK_N)* E28(LVDS0_D0_N)* E29(LVDS0_D1_P)* F28(LVDS0_D1_N)* F29(LVDS0_CLK_P)* G28(LVDS0_CLK_N)* G29(LVDS0_D2_P)* H28(LVDS0_D2_N)* H29(LVDS0_D3_P)* J28(LVDS0_D3_N)*

### Layout directives
net class CSI1_Z100: CSI1_CK_N, CSI1_CK_P, CSI1_D0_N, CSI1_D0_P, CSI1_D1_N, CSI1_D1_P, CSI1_D2_N, CSI1_D2_P, CSI1_D3_N, CSI1_D3_P
net class CSI2_Z100: CSI2_CK_N, CSI2_CK_P, CSI2_D0_N, CSI2_D0_P, CSI2_D1_N, CSI2_D1_P, CSI2_D2_N, CSI2_D2_P, CSI2_D3_N, CSI2_D3_P
differential pair; differential pair class Z100: CSI1_CK_N, CSI1_CK_P, CSI1_D0_N, CSI1_D0_P, CSI1_D1_N, CSI1_D1_P, CSI1_D2_N, CSI1_D2_P, CSI1_D3_N, CSI1_D3_P, CSI2_CK_N, CSI2_CK_P, CSI2_D0_N, CSI2_D0_P, CSI2_D1_N, CSI2_D1_P, CSI2_D2_N, CSI2_D2_P, CSI2_D3_N, CSI2_D3_P
differential pair; differential pair class Z90: 4G_USB_D_N, 4G_USB_D_P, USB1_D_N, USB1_D_P, USB1_RX_N, USB1_RX_P, USB1_TX_N, USB1_TX_P, USB2_RX_N, USB2_RX_P, USB2_TX_N, USB2_TX_P
net class Z90: (no net found under the mark)

### Notes on the sheet
- CPU PHY
- VBUS Voltage Range:0~3.3V
- (near C64) DNP
- DO NOT USE
- MIPI_TEST_DNU is for internal test, can be floating for normal use.
- 1. USB1_DNU, USB2_DNU are not functional, if USB ID function is needed, use common GPIO.
  2. If USB connector is MicroAB or MicroB, USBx_VBUS MUST not connect directly to the 5V VBUS voltage
  of connector; Instead, this pin must be isloated with an external 30K 1% resistor.
- PCB Des :
- Approv By :
- Project Title :
- Sheet Title :
- Date :
- Page :
- PCB Version :
- PCB Revision :
- Size :
- A2
- (in symbol IC_MPU_8M_PLUS_MIMX8ML8DVNLZAB, part B) i.MX8MP - USB
- (in symbol IC_MPU_8M_PLUS_MIMX8ML8DVNLZAB, part C) i.MX8MP - PCIe
- (in symbol IC_MPU_8M_PLUS_MIMX8ML8DVNLZAB, part D) i.MX8MP - DSI
- (in symbol IC_MPU_8M_PLUS_MIMX8ML8DVNLZAB, part E) i.MX8MP - CSI
- (in symbol IC_MPU_8M_PLUS_MIMX8ML8DVNLZAB, part F) i.MX8MP - HDMI
- (in symbol IC_MPU_8M_PLUS_MIMX8ML8DVNLZAB, part G) i.MX8MP - LVDS

### Library data of the parts
C64 C65 = CAP_2200pF_16V_X7R_0201: Multilayer Ceramic Capacitor, 2200 pF, 16 V, ± 10%, X7R, 0201 [0603 Metric]; Manufacturer: Murata; Supplier 1: Digikey; Manufacturer Part Number: GRM033R71C222KA88D; RoHS: Yes; Category: Ceramic Capacitors; Stock 1: 653022; Pricing 1: 1=0.1, 10=0.01, 50=0.0056, 100=0.0043, 500=0.00324, 1000=0.00255, 2500=0.00232, 5000=0.00213 (USD); Mount: Surface Mount; Case Code (Metric): 0603; Case Code (Imperial): 0201; Material: Ceramic; Min Operating Temperature: -55°C; Max Operating Temperature: 125°C; Package Quantity: 1; Tolerance: 10%; Packaging: Tape and Reel; Voltage Rating (DC): 16V; Dielectric: X7R; Termination: SMD/SMT; Voltage: 16V; Series: GRM; Construction: Flat; Length: 0.6mm; Width: 0.012inch; Height: 0.3mm; Thickness: 0.013inch; Depth: 0.3mm; Radiation Hardening: No; Reach SVHC Compliant: No; Lead Free: Lead Free; RoHS Compliant: Yes; ComponentLink1URL: https://datasheet.ciiva.com/130/grm033r71c222ka88-01-130159.pdf?src-supplier=Digikey; ComponentLink1Description: https://datasheet.ciiva.com/130/grm033r71c222ka88-01-130159.pdf?src-supplier=Digikey; ComponentLink2URL: https://datasheet.ciiva.com/130/grm033r71c222ka88-01-130158.pdf?src-supplier=Digikey; ComponentLink2Description: https://datasheet.ciiva.com/130/grm033r71c222ka88-01-130158.pdf?src-supplier=Digikey; ComponentLink3URL: https://datasheet.ciiva.com/130/product-130160.pdf?src-supplier=Digikey; ComponentLink3Description: https://datasheet.ciiva.com/130/product-130160.pdf?src-supplier=Digikey; ComponentLink4URL: https://datasheet.ciiva.com/18184/getdatasheetpartid-153132-18184090.pdf?src-supplier=Verical; ComponentLink4Description: https://datasheet.ciiva.com/18184/getdatasheetpartid-153132-18184090.pdf?src-supplier=Verical; ComponentLink5URL: https://datasheet.ciiva.com/29199/455766-da-01-en-vs-kondensator-0201-29199161.pdf?src-supplier=Conrad; ComponentLink5Description: https://datasheet.ciiva.com/29199/455766-da-01-en-vs-kondensator-0201-29199161.pdf?src-supplier=Conrad; ComponentLink6URL: https://datasheet.ciiva.com/11620/product-11620555.pdf?src-supplier=Avnet; ComponentLink6Description: https://datasheet.ciiva.com/11620/product-11620555.pdf?src-supplier=Avnet; Supplier Part Number 1: 490-3190-1-ND
R3 R5 = RES_200R_1%_50mW_0201: SMD Chip Resistor, 200 Ohm, ± 1%, 50 mW, 0201 [0603 Metric], Thick Film, General Purpose; Manufacturer: Yageo; Voltage Rating: 25V; Power Rating: 50mW; Temperature Coefficient: 200ppm/°C; Supplier 1: Mouser; Manufacturer Part Number: RC0201FR-07200RL; RoHS: Yes; Category: Chip SMD Resistors; Stock 1: 289096; Pricing 1: 1=0.1, 10=0.015, 50=0.015, 100=0.008, 1000=0.006, 10000=0.006 (USD); Case Code (Imperial): 0201; Case Code (Metric): 0603; Size Code: 0201; Min Operating Temperature: -55°C; Max Operating Temperature: 125°C; Package Quantity: 10000; Packaging: Tape and Reel; Termination: SMD/SMT; Number of Terminations: 2; Max Power Dissipation: 50mW; Features: Moisture Resistant; Series: RC; Length: 0.6mm; Width: 0.3mm; Height: 0.23mm; Lead Free: Lead Free; RoHS Compliant: Yes; ComponentLink1URL: http://www.mouser.com/ds/2/447/RC0201-559633.pdf?src-supplier=Mouser; ComponentLink1Description: http://www.mouser.com/ds/2/447/RC0201-559633.pdf?src-supplier=Mouser; ComponentLink2URL: https://datasheet.octopart.com/RC0201FR-07200RL-Yageo-datasheet-164759695.pdf?src-supplier=Future+Electronics; ComponentLink2Description: https://datasheet.octopart.com/RC0201FR-07200RL-Yageo-datasheet-164759695.pdf?src-supplier=Future+Electronics; ComponentLink3URL: http://www.yageo.com/documents/recent/PYu-RC0201_51_RoHS_L_(8).pdf?src-supplier=Future+Electronics; ComponentLink3Description: http://www.yageo.com/documents/recent/PYu-RC0201_51_RoHS_L_(8).pdf?src-supplier=Future+Electronics; ComponentLink4URL: http://www.yageo.com/documents/recent/PYu-RC_Group_51_RoHS_L_10.pdf?src-supplier=Digikey; ComponentLink4Description: http://www.yageo.com/documents/recent/PYu-RC_Group_51_RoHS_L_10.pdf?src-supplier=Digikey; ComponentLink5URL: http://www.yageo.com/documents/recent/PYu-RC_Group_51_RoHS_L_9.pdf?src-supplier=Digikey; ComponentLink5Description: http://www.yageo.com/documents/recent/PYu-RC_Group_51_RoHS_L_9.pdf?src-supplier=Digikey; Supplier Part Number 1: 603-RC0201FR-07200RL
R4 R6 = RES_8.2K_1%_50mW_0201: Res Thick Film 0201 8.2K Ohm 1% 1/20W ±200ppm/°C Molded SMD Paper T/R; Manufacturer: Yageo; Power Rating: 50mW; Voltage Rating: 25V; Supplier 1: Digikey; Manufacturer Part Number: RC0201FR-078K2L; RoHS: Yes; Category: Chip SMD Resistors; Stock 1: 120132; Pricing 1: 1=0.1, 10=0.027, 50=0.0172, 100=0.0143, 500=0.00988, 1000=0.00854, 5000=0.00629 (USD); Case Code (Metric): 0603; Case Code (Imperial): 0201; Min Operating Temperature: -55°C; Max Operating Temperature: 125°C; Package Quantity: 10000; Packaging: Tape and Reel; Resistor Type: Thick Film; Number of Terminations: 2; Termination: SMD/SMT; Max Power Dissipation: 50mW; Temperature Coefficient: 200ppm/°C; Features: Moisture Resistant; Series: RC; Resistance Tolerance: 1%; Length: 0.024inch; Width: 0.3mm; Height: 0.01inch; Reach SVHC Compliant: No; Lead Free: Lead Free; RoHS Compliant: Yes; ComponentLink1URL: https://datasheet.ciiva.com/14985/pyu-r-int-thick-7-14985436.pdf?src-supplier=Digikey; ComponentLink1Description: https://datasheet.ciiva.com/14985/pyu-r-int-thick-7-14985436.pdf?src-supplier=Digikey; Supplier Part Number 1: YAG2353CT-ND
U1 = IC_MPU_8M_PLUS_MIMX8ML8DVNLZAB: as U1 on sheet CPU IO; Supplier 1: Arrow Electronics; Manufacturer Part Number: MIMX8ML8DVNLZAB; RoHS: Yes; Category: Microprocessors; Stock 1: 1036; Pricing 1: 1=54.8, 5=52.24, 10=44.19, 25=42.8, 50=39.95, 100=31.83 (USD); Supplier Part Number 1: MIMX8ML8DVNLZAB